# EAGLE design module_bga (EAGLE 9.4.0)

## Sheet 1 of 5
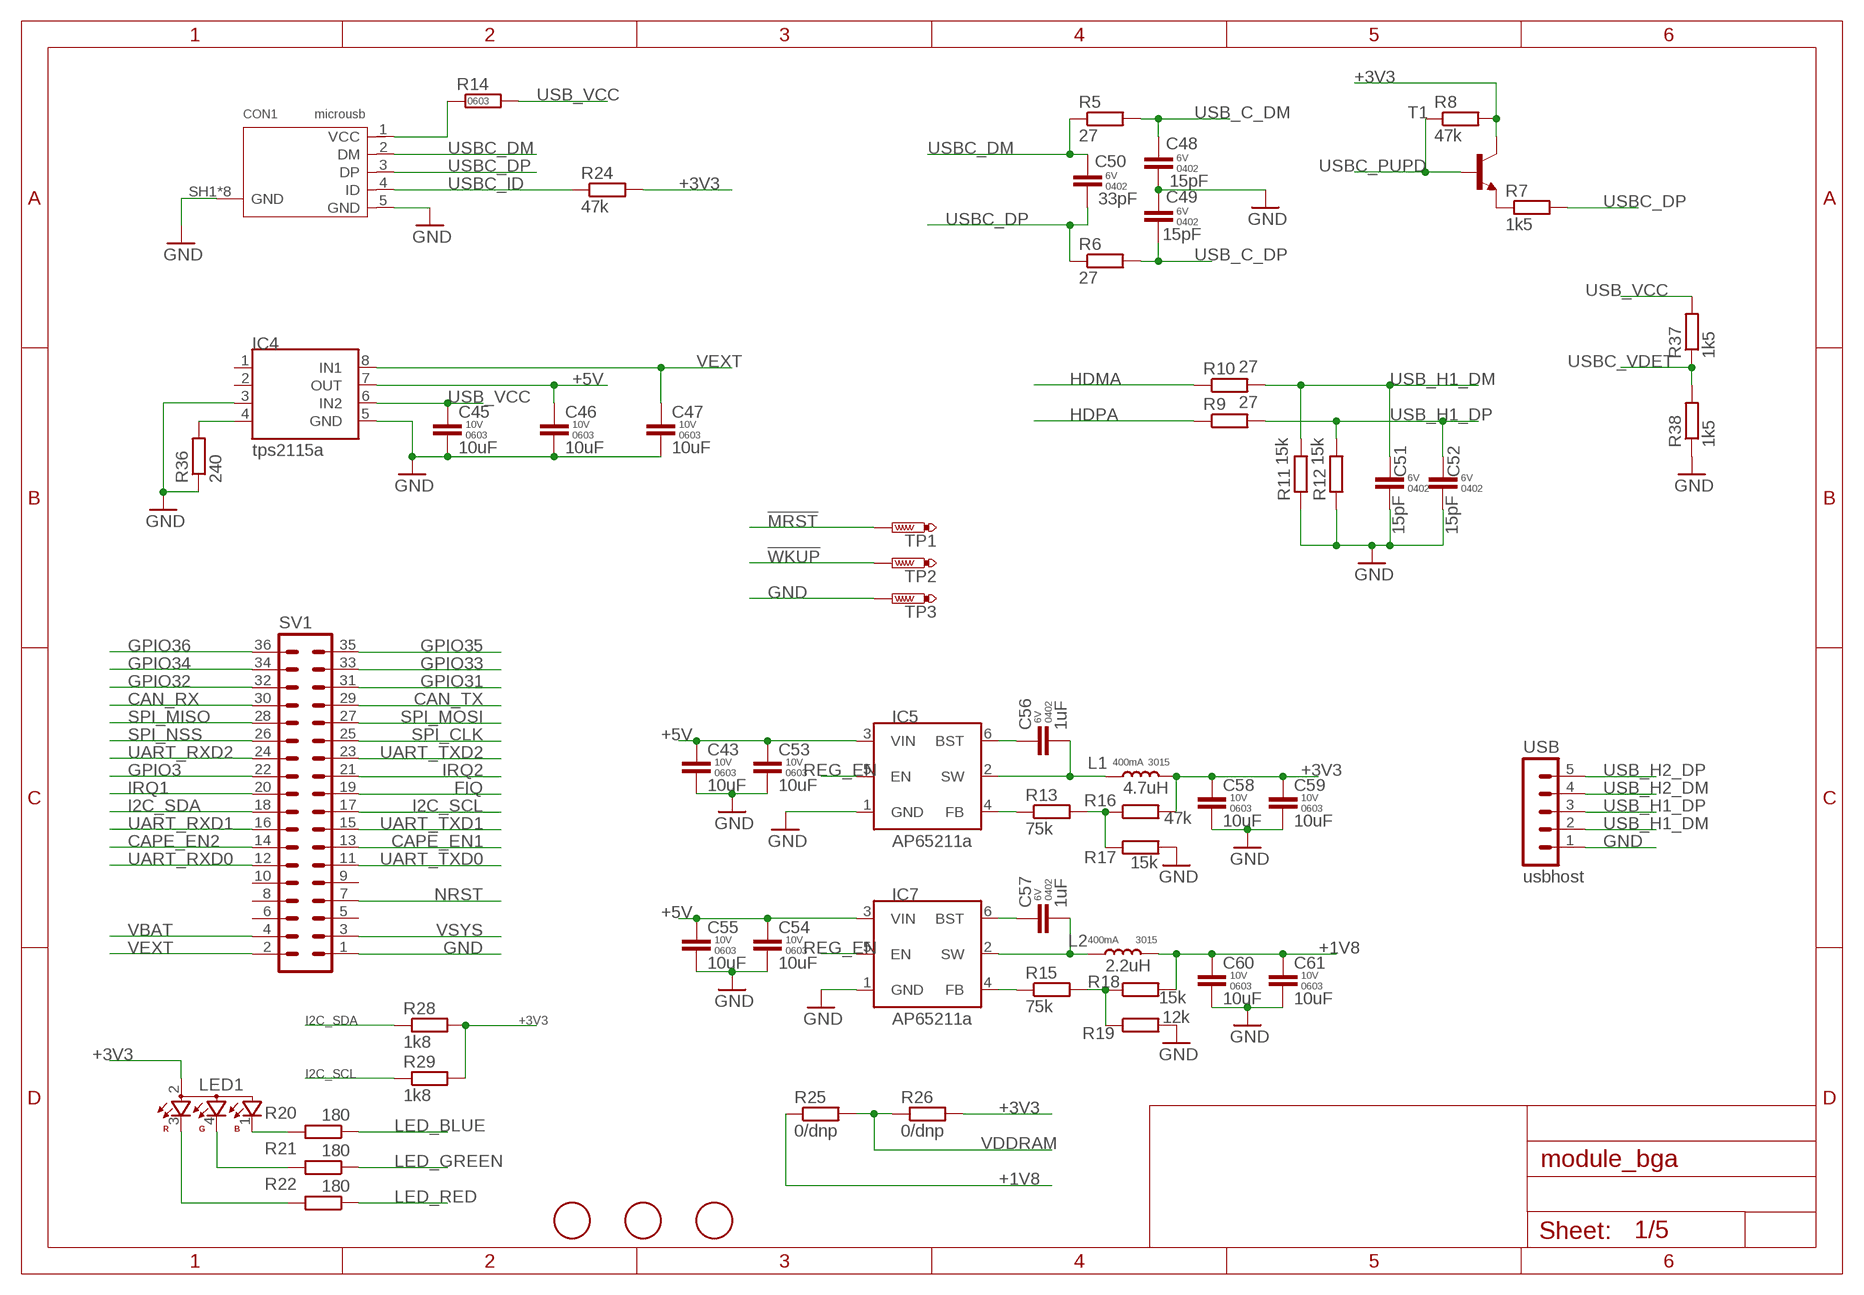
[diagram p0: schematic, sheet 1]

### Parts
C43  10uF  CAP-0603  [C0603]
C45  10uF  CAP-0603  [C0603]
C46  10uF  CAP-0603  [C0603]
C47  10uF  CAP-0603  [C0603]
C48  15pF  CAP-0402  [C0402K]
C49  15pF  CAP-0402  [C0402K]
C50  33pF  CAP-0402  [C0402K]
C51  15pF  CAP-0402  [C0402K]
C52  15pF  CAP-0402  [C0402K]
C53  10uF  CAP-0603  [C0603]
C54  10uF  CAP-0603  [C0603]
C55  10uF  CAP-0603  [C0603]
C56  1uF  CAP-0402  [C0402K]
C57  1uF  CAP-0402  [C0402K]
C58  10uF  CAP-0603  [C0603]
C59  10uF  CAP-0603  [C0603]
C60  10uF  CAP-0603  [C0603]
C61  10uF  CAP-0603  [C0603]
CON1  microusb  10118194-0001LF  [10118194]
IC4  tps2115a  TPS2115A  [TSSOP8]
IC5  AP65211  [SOT95P280X110-6]
IC7  AP65211  [SOT95P280X110-6]
L1  4.7uH  DJNR3015  [L3230M]
L2  2.2uH  DJNR3015  [L3230M]
LED1  OSTB1204C1E  [321015RGB]
R5  27  R-EU_R0402  [R0402]
R6  27  R-EU_R0402  [R0402]
R7  1k5  R-EU_R0402  [R0402]
R8  47k  R-EU_R0402  [R0402]
R9  27  R-EU_R0402  [R0402]
R10  27  R-EU_R0402  [R0402]
R11  15k  R-EU_R0402  [R0402]
R12  15k  R-EU_R0402  [R0402]
R13  75k  R-EU_R0402  [R0402]
R14  RES-0603  [R0603]
R15  75k  R-EU_R0402  [R0402]
R16  47k  R-EU_R0402  [R0402]
R17  15k  R-EU_R0402  [R0402]
R18  15k  R-EU_R0402  [R0402]
R19  12k  R-EU_R0402  [R0402]
R20  180  R-EU_R0402  [R0402]
R21  180  R-EU_R0402  [R0402]
R22  180  R-EU_R0402  [R0402]
R24  47k  R-EU_R0402  [R0402]
R25  0/dnp  R-EU_R0603  [R0603]
R26  0/dnp  R-EU_R0603  [R0603]
R28  1k8  R-EU_R0402  [R0402]
R29  1k8  R-EU_R0402  [R0402]
R36  240  R-EU_R0402  [R0402]
R37  1k5  R-EU_R0402  [R0402]
R38  1k5  R-EU_R0402  [R0402]
SV1  MA18-2  [MA18-2]
T1  MMBT2222ALT1-NPN-SOT23-BEC  [SOT23-BEC]
TP1  PTR1B1,27  [B1,27]
TP2  PTR1B1,27  [B1,27]
TP3  PTR1B1,27  [B1,27]
U$1  FIDUCIAL  [FIDUCIAL_1MM]
U$2  FIDUCIAL  [FIDUCIAL_1MM]
U$3  FIDUCIAL  [FIDUCIAL_1MM]
USB  usbhost  MA05-1  [MA05-1]

### Nets
!MRST: TP1.TP ; also sheet 2
!WKUP: TP2.TP ; also sheet 2
+1V8: C60.1 C61.1 L2.2 R18.2 R25.1 ; also sheet 2
+3V3: C58.1 C59.1 L1.2 LED1.2 R8.2 R16.2 R24.2 R26.2 R28.2 R29.2 T1.C ; also sheet 2,5
+5V: C43.1 C46.1 C53.1 C54.1 C55.1 IC4.7(OUT) IC5.3(VIN) IC7.3(VIN)
CAN_RX: SV1.30
CAN_TX: SV1.29
CAPE_EN1: SV1.13
CAPE_EN2: SV1.14
FIQ: SV1.19 ; also sheet 2
GND: C43.2 C45.2 C46.2 C47.2 C48.2 C49.2 C51.2 C52.2 C53.2 C54.2 C55.2 C58.2 C59.2 C60.2 C61.2 CON1.5(GND) CON1.SH1(GND) CON1.SH2(GND) CON1.SH3(GND) CON1.SH4(GND) CON1.SH5(GND) CON1.SH6(GND) CON1.SH7(GND) CON1.SH8(GND) IC4.3 IC4.5(GND) IC5.1(GND) IC7.1(GND) R11.1 R12.1 R17.2 R19.2 R36.1 R38.1 SV1.1 TP3.TP USB.1 ; also sheet 2,3,5
GPIO3: SV1.22
GPIO31: SV1.31 ; also sheet 2
GPIO32: SV1.32 ; also sheet 2
GPIO33: SV1.33 ; also sheet 2
GPIO34: SV1.34 ; also sheet 2
GPIO35: SV1.35 ; also sheet 2
GPIO36: SV1.36 ; also sheet 2
HDMA: R10.1 ; also sheet 2
HDPA: R9.1 ; also sheet 2
I2C_SCL: R29.1 SV1.17 ; also sheet 2
I2C_SDA: R28.1 SV1.18 ; also sheet 2
IRQ1: SV1.20 ; also sheet 2
IRQ2: SV1.21 ; also sheet 2
LED_BLUE: R20.1 ; also sheet 2
LED_GREEN: R21.1 ; also sheet 2
LED_RED: R22.1 ; also sheet 2
N$3: C56.2 IC5.2(SW) L1.1
N$4: CON1.1(VCC) R14.1
N$6: IC4.4 R36.2
N$8: C57.2 IC7.2(SW) L2.1
N$9: LED1.1 R20.2
N$10: C56.1 IC5.6(BST)
N$11: C57.1 IC7.6(BST)
N$14: LED1.4 R21.2
N$15: IC7.4(FB) R15.1
N$18: R7.1 T1.E
N$20: IC5.4(FB) R13.1
N$21: R15.2 R18.1 R19.1
N$22: R13.2 R16.1 R17.1
N$23: LED1.3 R22.2
NRST: SV1.7 ; also sheet 2
REG_EN: IC5.5(EN) IC7.5(EN)
SPI_CLK: SV1.25 ; also sheet 2
SPI_MISO: SV1.28 ; also sheet 2
SPI_MOSI: SV1.27 ; also sheet 2
SPI_NSS: SV1.26 ; also sheet 2
UART_RXD0: SV1.12 ; also sheet 2
UART_RXD1: SV1.16 ; also sheet 2
UART_RXD2: SV1.24 ; also sheet 2
UART_TXD0: SV1.11 ; also sheet 2
UART_TXD1: SV1.15 ; also sheet 2
UART_TXD2: SV1.23 ; also sheet 2
USB_C_DM: C48.1 R5.2 ; also sheet 2
USB_C_DP: C49.1 R6.2 ; also sheet 2
USB_H1_DM: C51.1 R10.2 R11.2 USB.2
USB_H1_DP: C52.1 R9.2 R12.2 USB.3
USB_H2_DM: USB.4
USB_H2_DP: USB.5
USB_VCC: C45.1 IC4.6(IN2) R14.2 R37.2
USBC_DM: C50.1 CON1.2(DM) R5.1
USBC_DP: C50.2 CON1.3(DP) R6.1 R7.2
USBC_ID: CON1.4(ID) R24.1 ; also sheet 2
USBC_PUPD: R8.1 T1.B ; also sheet 2
USBC_VDET: R37.1 R38.2 ; also sheet 2
VBAT: SV1.4
VDDRAM: R25.2 R26.1 ; also sheet 2,3
VEXT: C47.1 IC4.8(IN1) SV1.2
VSYS: SV1.3
Unconnected: IC4.1 IC4.2 SV1.5 SV1.6 SV1.8 SV1.9 SV1.10

## Sheet 2 of 5
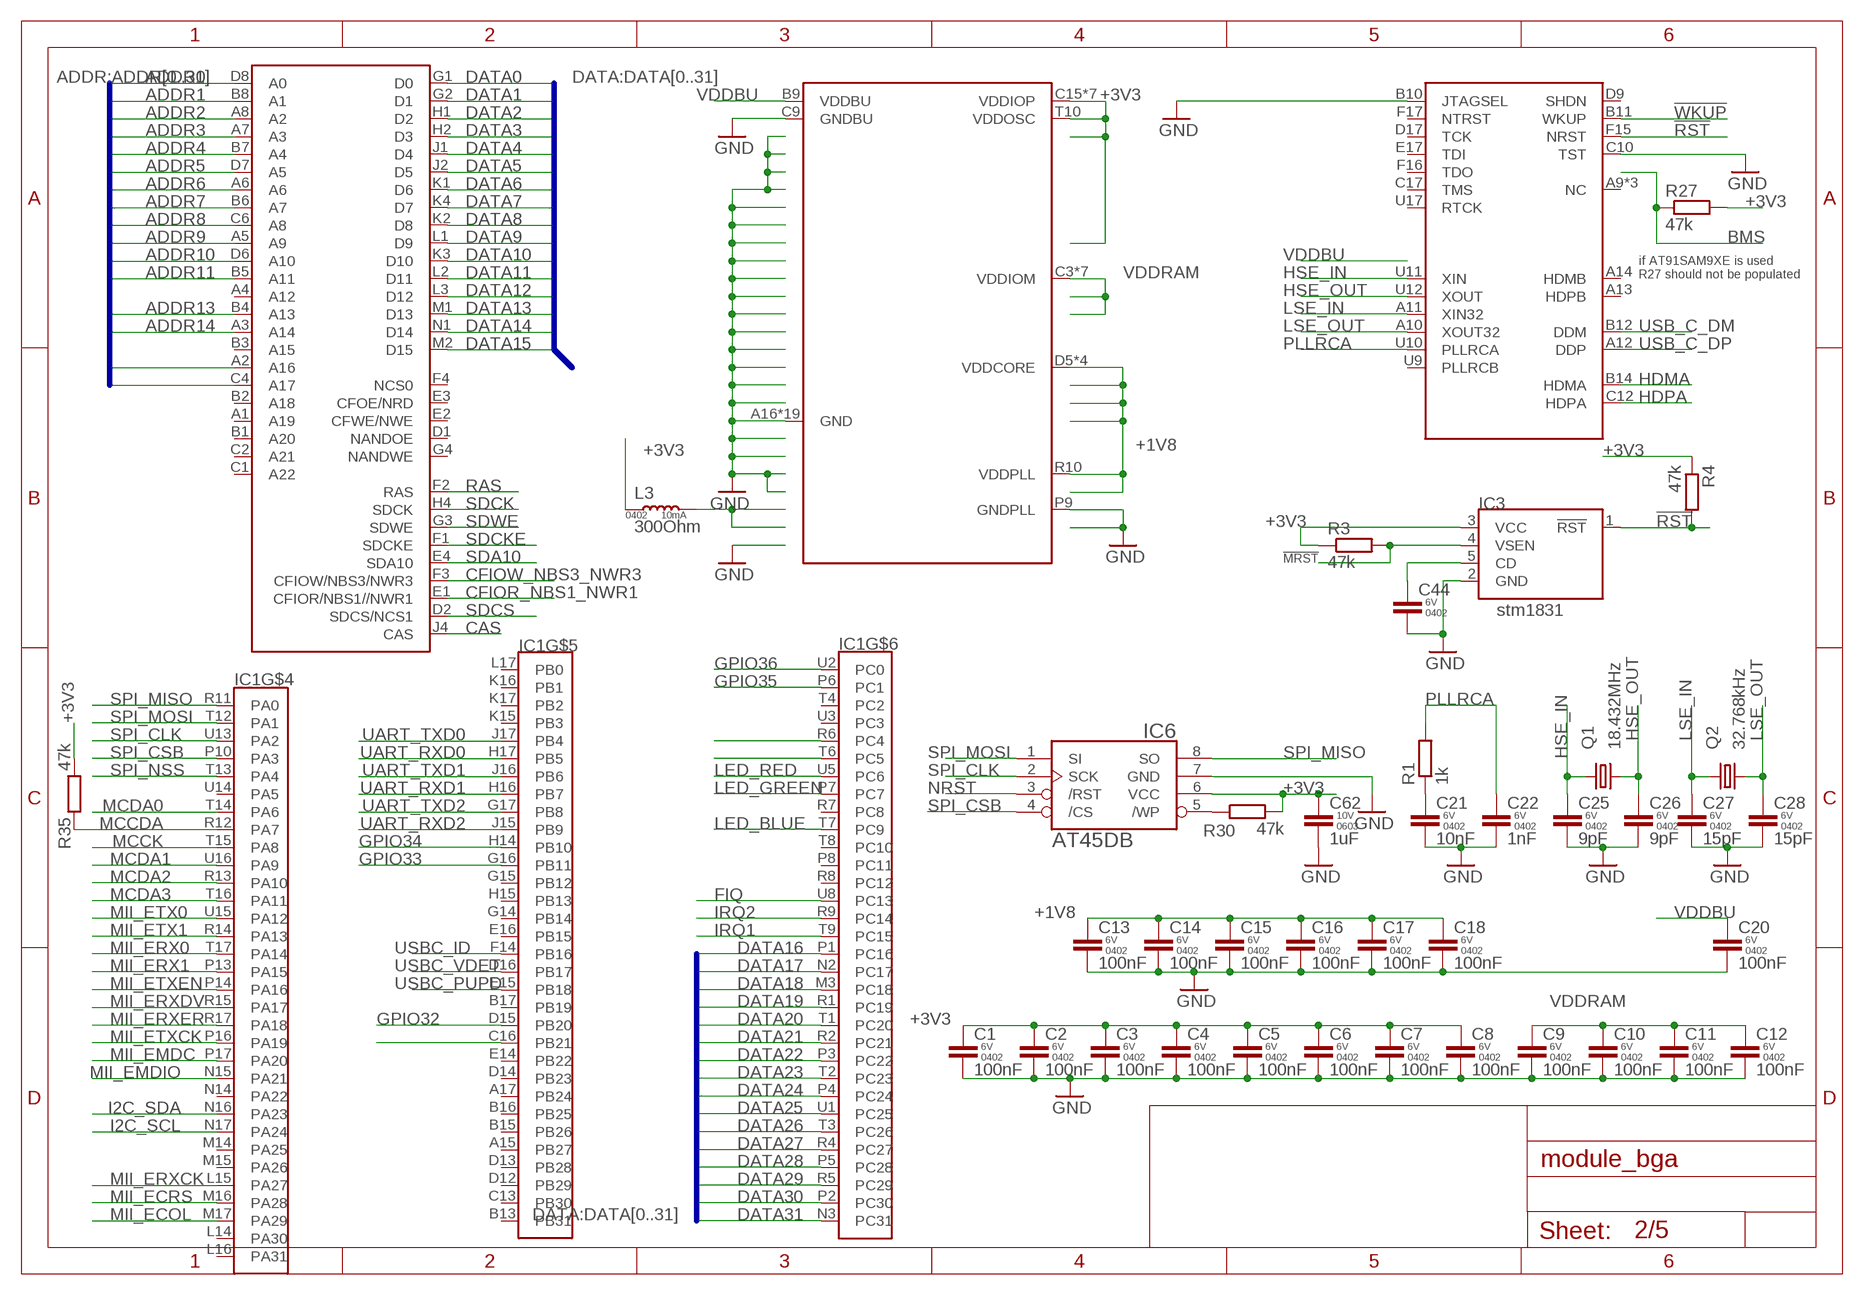
[diagram p1: schematic, sheet 2]

### Parts
C1  100nF  CAP-0402  [C0402K]
C2  100nF  CAP-0402  [C0402K]
C3  100nF  CAP-0402  [C0402K]
C4  100nF  CAP-0402  [C0402K]
C5  100nF  CAP-0402  [C0402K]
C6  100nF  CAP-0402  [C0402K]
C7  100nF  CAP-0402  [C0402K]
C8  100nF  CAP-0402  [C0402K]
C9  100nF  CAP-0402  [C0402K]
C10  100nF  CAP-0402  [C0402K]
C11  100nF  CAP-0402  [C0402K]
C12  100nF  CAP-0402  [C0402K]
C13  100nF  CAP-0402  [C0402K]
C14  100nF  CAP-0402  [C0402K]
C15  100nF  CAP-0402  [C0402K]
C16  100nF  CAP-0402  [C0402K]
C17  100nF  CAP-0402  [C0402K]
C18  100nF  CAP-0402  [C0402K]
C20  100nF  CAP-0402  [C0402K]
C21  10nF  CAP-0402  [C0402K]
C22  1nF  CAP-0402  [C0402K]
C25  9pF  CAP-0402  [C0402K]
C26  9pF  CAP-0402  [C0402K]
C27  15pF  CAP-0402  [C0402K]
C28  15pF  CAP-0402  [C0402K]
C44  CAP-0402  [C0402K]
C62  1uF  CAP-0603  [C0603]
IC1  AT91SAM9261-BGA  [BGA217C80P17X17_1500X1500X100]
IC3  stm1831  STM1831  [SOT95P280X100-5]
IC6  AT45DB-S  [SO08-208]
L3  300Ohm  IND-0402  [L0402]
Q1  18.432MHz  3215-7  [3215]
Q2  32.768kHz  CFPX–217-NHT  [3215]
R1  1k  R-EU_R0402  [R0402]
R3  47k  R-EU_R0402  [R0402]
R4  47k  R-EU_R0402  [R0402]
R27  47k  R-EU_R0402  [R0402]
R30  47k  R-EU_R0402  [R0402]
R35  47k  R-EU_R0402  [R0402]

### Nets
!MRST: IC3.4(VSEN) R3.2 ; also sheet 1
!RST: IC1.F15(NRST) IC3.1(!RST) R4.2
!WKUP: IC1.B11(WKUP) ; also sheet 1
+1V8: C13.1 C14.1 C15.1 C16.1 C17.1 C18.1 IC1.D5(VDDCORE) IC1.K14(VDDCORE) IC1.M4(VDDCORE) IC1.P12(VDDCORE) IC1.R10(VDDPLL) ; also sheet 1
+3V3: C1.1 C2.1 C3.1 C4.1 C5.1 C6.1 C7.1 C8.1 C62.1 IC1.C15(VDDIOP) IC1.D11(VDDIOP) IC1.J14(VDDIOP) IC1.P11(VDDIOP) IC1.P15(VDDIOP) IC1.T5(VDDIOP) IC1.T10(VDDOSC) IC1.U6(VDDIOP) IC3.3(VCC) IC6.6(VCC) L3.1 R3.1 R4.1 R27.2 R30.2 R35.2 ; also sheet 1,5
ADDR0: IC1.D8(A0) ; also sheet 3
ADDR1: IC1.B8(A1) ; also sheet 3
ADDR2: IC1.A8(A2) ; also sheet 3
ADDR3: IC1.A7(A3) ; also sheet 3
ADDR4: IC1.B7(A4) ; also sheet 3
ADDR5: IC1.D7(A5) ; also sheet 3
ADDR6: IC1.A6 ; also sheet 3
ADDR7: IC1.B6(A7) ; also sheet 3
ADDR8: IC1.C6(A8) ; also sheet 3
ADDR9: IC1.A5(A9) ; also sheet 3
ADDR10: IC1.D6(A10) ; also sheet 3
ADDR11: IC1.B5(A11) ; also sheet 3
ADDR13: IC1.B4(A13) ; also sheet 3
ADDR14: IC1.A3(A14) ; also sheet 3
ADDR16: IC1.A2(A16) ; also sheet 3
ADDR17: IC1.C4(A17) ; also sheet 3
BMS: R27.1
CAS: IC1.J4(CAS) ; also sheet 3
CFIOR_NBS1_NWR1: IC1.E1(CFIOR/NBS1//NWR1) ; also sheet 3
CFIOW_NBS3_NWR3: IC1.F3(CFIOW/NBS3/NWR3) ; also sheet 3
DATA0: IC1.G1(D0) ; also sheet 3
DATA1: IC1.G2(D1) ; also sheet 3
DATA2: IC1.H1(D2) ; also sheet 3
DATA3: IC1.H2(D3) ; also sheet 3
DATA4: IC1.J1(D4) ; also sheet 3
DATA5: IC1.J2(D5) ; also sheet 3
DATA6: IC1.K1(D6) ; also sheet 3
DATA7: IC1.K4(D7) ; also sheet 3
DATA8: IC1.K2(D8) ; also sheet 3
DATA9: IC1.L1(D9) ; also sheet 3
DATA10: IC1.K3(D10) ; also sheet 3
DATA11: IC1.L2(D11) ; also sheet 3
DATA12: IC1.L3(D12) ; also sheet 3
DATA13: IC1.M1(D13) ; also sheet 3
DATA14: IC1.N1(D14) ; also sheet 3
DATA15: IC1.M2(D15) ; also sheet 3
DATA16: IC1.P1(PC16) ; also sheet 3
DATA17: IC1.N2(PC17) ; also sheet 3
DATA18: IC1.M3(PC18) ; also sheet 3
DATA19: IC1.R1(PC19) ; also sheet 3
DATA20: IC1.T1(PC20) ; also sheet 3
DATA21: IC1.R2(PC21) ; also sheet 3
DATA22: IC1.P3(PC22) ; also sheet 3
DATA23: IC1.T2(PC23) ; also sheet 3
DATA24: IC1.P4(PC24) ; also sheet 3
DATA25: IC1.U1(PC25) ; also sheet 3
DATA26: IC1.T3(PC26) ; also sheet 3
DATA27: IC1.R4(PC27) ; also sheet 3
DATA28: IC1.P5(PC28) ; also sheet 3
DATA29: IC1.R5(PC29) ; also sheet 3
DATA30: IC1.P2(PC30) ; also sheet 3
DATA31: IC1.N3(PC31) ; also sheet 3
FIQ: IC1.U8(PC13) ; also sheet 1
GND: C1.2 C2.2 C3.2 C4.2 C5.2 C6.2 C7.2 C8.2 C9.2 C10.2 C11.2 C12.2 C13.2 C14.2 C15.2 C16.2 C17.2 C18.2 C20.2 C21.2 C22.2 C25.2 C26.2 C27.2 C28.2 C44.2 C62.2 IC1.A16(GND) IC1.C7(GND) IC1.C9(GNDBU) IC1.C10(TST) IC1.C11(GND) IC1.D3(GND) IC1.H8(GND) IC1.H9(GND) IC1.H10(GND) IC1.J3(GND) IC1.J8(GND) IC1.J9(GND) IC1.J10(GND) IC1.K8(GND) IC1.K9(GND) IC1.K10(GND) IC1.P9(GNDPLL) IC1.R3(GND) IC1.R16(GND) IC1.T11(GND) IC1.U4(GND) IC1.U7(GND) IC3.2(GND) IC6.7(GND) ; also sheet 1,3,5
GPIO31: IC1.C16(PB21) ; also sheet 1
GPIO32: IC1.D15(PB20) ; also sheet 1
GPIO33: IC1.G16(PB11) ; also sheet 1
GPIO34: IC1.H14(PB10) ; also sheet 1
GPIO35: IC1.P6(PC1) ; also sheet 1
GPIO36: IC1.U2(PC0) ; also sheet 1
HDMA: IC1.B14(HDMA) ; also sheet 1
HDPA: IC1.C12(HDPA) ; also sheet 1
HSE_IN: C25.1 IC1.U11(XIN) Q1.1
HSE_OUT: C26.1 IC1.U12(XOUT) Q1.3
I2C_SCL: IC1.N17(PA24) ; also sheet 1
I2C_SDA: IC1.N16(PA23) ; also sheet 1
IRQ1: IC1.T9(PC15) ; also sheet 1
IRQ2: IC1.R9(PC14) ; also sheet 1
LED_BLUE: IC1.T7(PC9) ; also sheet 1
LED_GREEN: IC1.P7(PC7) ; also sheet 1
LED_RED: IC1.U5(PC6) ; also sheet 1
LSE_IN: C27.1 IC1.A11(XIN32) Q2.1
LSE_OUT: C28.1 IC1.A10(XOUT32) Q2.2
MCCDA: IC1.R12(PA7) R35.1 ; also sheet 5
MCCK: IC1.T15(PA8) ; also sheet 5
MCDA0: IC1.T14(PA6) ; also sheet 5
MCDA1: IC1.U16(PA9) ; also sheet 5
MCDA2: IC1.R13(PA10) ; also sheet 5
MCDA3: IC1.T16(PA11) ; also sheet 5
MII_ECOL: IC1.M17(PA29)
MII_ECRS: IC1.M16(PA28)
MII_EMDC: IC1.P17(PA20) ; also sheet 4
MII_EMDIO: IC1.N15(PA21) ; also sheet 4
MII_ERX0: IC1.T17(PA14) ; also sheet 4
MII_ERX1: IC1.P13(PA15) ; also sheet 4
MII_ERXCK: IC1.L15(PA27)
MII_ERXDV: IC1.R15(PA17)
MII_ERXER: IC1.R17(PA18) ; also sheet 4
MII_ETX0: IC1.U15(PA12) ; also sheet 4
MII_ETX1: IC1.R14(PA13) ; also sheet 4
MII_ETXCK: IC1.P16(PA19) ; also sheet 4
MII_ETXEN: IC1.P14(PA16) ; also sheet 4
N$1: C21.1 R1.1
N$2: IC6.5(/WP) R30.1
N$5: IC1.B10(JTAGSEL) ; supply symbol labelled GND
N$13: IC1.T6(PC5)
N$16: IC1.R6(PC4)
N$17: C44.1 IC3.5(CD)
N$28: L3.2
NRST: IC6.3(/RST) ; also sheet 1
PLLRCA: C22.1 IC1.U10(PLLRCA) R1.2
RAS: IC1.F2(RAS) ; also sheet 3
SDA10: IC1.E4(SDA10) ; also sheet 3
SDCK: IC1.H4(SDCK) ; also sheet 3
SDCKE: IC1.F1(SDCKE) ; also sheet 3
SDCS: IC1.D2(SDCS/NCS1) ; also sheet 3
SDWE: IC1.G3(SDWE) ; also sheet 3
SPI_CLK: IC1.U13(PA2) IC6.2(SCK) ; also sheet 1
SPI_CSB: IC1.P10(PA3) IC6.4(/CS)
SPI_MISO: IC1.R11(PA0) IC6.8(SO) ; also sheet 1
SPI_MOSI: IC1.T12(PA1) IC6.1(SI) ; also sheet 1
SPI_NSS: IC1.T13(PA4) ; also sheet 1
UART_RXD0: IC1.H17(PB5) ; also sheet 1
UART_RXD1: IC1.H16(PB7) ; also sheet 1
UART_RXD2: IC1.J15(PB9) ; also sheet 1
UART_TXD0: IC1.J17(PB4) ; also sheet 1
UART_TXD1: IC1.J16(PB6) ; also sheet 1
UART_TXD2: IC1.G17(PB8) ; also sheet 1
USB_C_DM: IC1.B12(DDM) ; also sheet 1
USB_C_DP: IC1.A12(DDP) ; also sheet 1
USBC_ID: IC1.F14(PB16) ; also sheet 1
USBC_PUPD: IC1.E15(PB18) ; also sheet 1
USBC_VDET: IC1.D16(PB17) ; also sheet 1
VDDBU: C20.1 IC1.B9(VDDBU)
VDDRAM: C9.1 C10.1 C11.1 C12.1 IC1.C3(VDDIOM) IC1.C5(VDDIOM) IC1.C8(VDDIOM) IC1.D4(VDDIOM) IC1.H3(VDDIOM) IC1.L4(VDDIOM) IC1.N4(VDDIOM) ; also sheet 1,3
Unconnected: IC1.A1(A19) IC1.A4(A12) IC1.A9(NC) IC1.A13(HDPB) IC1.A14(HDMB) IC1.A15(PB27) IC1.A17(PB24) IC1.B1(A20) IC1.B2(A18) IC1.B3(A15) IC1.B13(PB31) IC1.B15(PB26) IC1.B16(PB25) IC1.B17(PB19) IC1.C1(A22) IC1.C2(A21) IC1.C13(PB30) IC1.C14(NC) IC1.C17(TMS) IC1.D1(NANDOE) IC1.D9(SHDN) IC1.D10(NC) IC1.D12(PB29) IC1.D13(PB28) IC1.D14(PB23) IC1.D17(TCK) IC1.E2(CFWE/NWE) IC1.E3(CFOE/NRD) IC1.E14(PB22) IC1.E16(PB15) IC1.E17(TDI) IC1.F4(NCS0) IC1.F16(TDO) IC1.F17(NTRST) IC1.G4(NANDWE) IC1.G14(PB14) IC1.G15(PB12) IC1.H15(PB13) IC1.K15(PB3) IC1.K16(PB1) IC1.K17(PB2) IC1.L14(PA30) IC1.L16(PA31) IC1.L17(PB0) IC1.M14(PA25) IC1.M15(PA26) IC1.N14(PA22) IC1.P8(PC11) IC1.R7(PC8) IC1.R8(PC12) IC1.T4(PC2) IC1.T8(PC10) IC1.U3(PC3) IC1.U9(PLLRCB) IC1.U14(PA5) IC1.U17(RTCK)

### Buses
ADDR:ADDR[0..31]
DATA:DATA[0..31]

### Notes on the sheet
- if AT91SAM9XE is used 
  R27 should not be populated

## Sheet 3 of 5: SDRAM
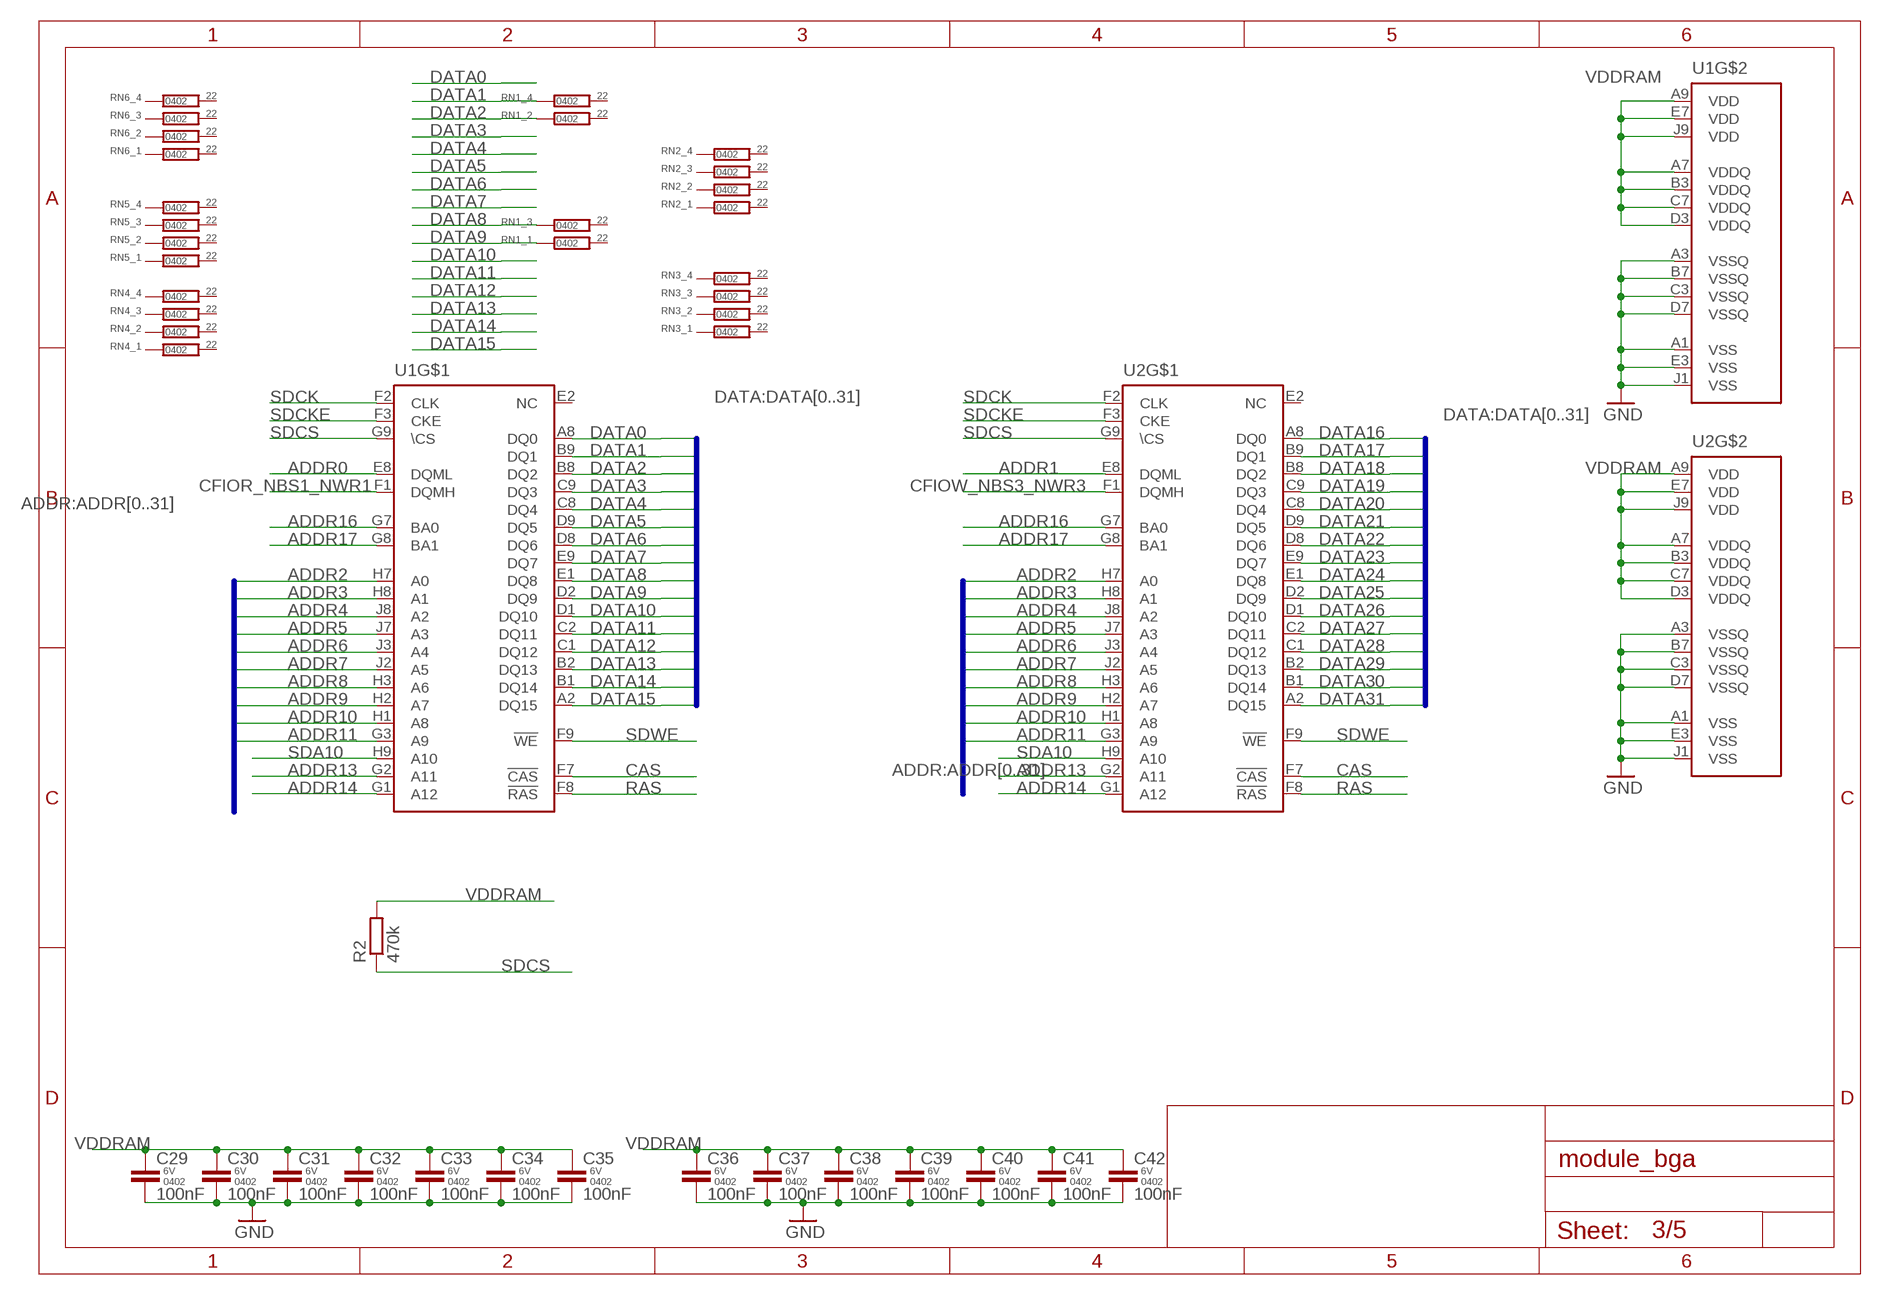
[diagram p2: schematic, sheet 3]

### Parts
C29  100nF  CAP-0402  [C0402K]
C30  100nF  CAP-0402  [C0402K]
C31  100nF  CAP-0402  [C0402K]
C32  100nF  CAP-0402  [C0402K]
C33  100nF  CAP-0402  [C0402K]
C34  100nF  CAP-0402  [C0402K]
C35  100nF  CAP-0402  [C0402K]
C36  100nF  CAP-0402  [C0402K]
C37  100nF  CAP-0402  [C0402K]
C38  100nF  CAP-0402  [C0402K]
C39  100nF  CAP-0402  [C0402K]
C40  100nF  CAP-0402  [C0402K]
C41  100nF  CAP-0402  [C0402K]
C42  100nF  CAP-0402  [C0402K]
R2  470k  R-EU_R0402  [R0402]
RN1  22  4D02WGJ0220  [4D02]
RN2  22  4D02WGJ0220  [4D02]
RN3  22  4D02WGJ0220  [4D02]
RN4  22  4D02WGJ0220  [4D02]
RN5  22  4D02WGJ0220  [4D02]
RN6  22  4D02WGJ0220  [4D02]
U1  IS42S16160G  [FBGA54]
U2  IS42S16160G  [FBGA54]

### Nets
ADDR0: U1.E8(DQML) ; also sheet 2
ADDR1: U2.E8(DQML) ; also sheet 2
ADDR2: U1.H7(A0) U2.H7(A0) ; also sheet 2
ADDR3: U1.H8(A1) U2.H8(A1) ; also sheet 2
ADDR4: U1.J8(A2) U2.J8(A2) ; also sheet 2
ADDR5: U1.J7(A3) U2.J7(A3) ; also sheet 2
ADDR6: U1.J3(A4) U2.J3(A4) ; also sheet 2
ADDR7: U1.J2(A5) U2.J2(A5) ; also sheet 2
ADDR8: U1.H3(A6) U2.H3(A6) ; also sheet 2
ADDR9: U1.H2(A7) U2.H2(A7) ; also sheet 2
ADDR10: U1.H1(A8) U2.H1(A8) ; also sheet 2
ADDR11: U1.G3(A9) U2.G3(A9) ; also sheet 2
ADDR13: U1.G2(A11) U2.G2(A11) ; also sheet 2
ADDR14: U1.G1(A12) U2.G1(A12) ; also sheet 2
ADDR16: U1.G7(BA0) U2.G7(BA0) ; also sheet 2
ADDR17: U1.G8(BA1) U2.G8(BA1) ; also sheet 2
CAS: U1.F7(!CAS) U2.F7(!CAS) ; also sheet 2
CFIOR_NBS1_NWR1: U1.F1(DQMH) ; also sheet 2
CFIOW_NBS3_NWR3: U2.F1(DQMH) ; also sheet 2
DATA0: U1.A8(DQ0) ; also sheet 2
DATA1: RN1.4 U1.B9(DQ1) ; also sheet 2
DATA2: RN1.2 U1.B8(DQ2) ; also sheet 2
DATA3: U1.C9(DQ3) ; also sheet 2
DATA4: U1.C8(DQ4) ; also sheet 2
DATA5: U1.D9(DQ5) ; also sheet 2
DATA6: U1.D8(DQ6) ; also sheet 2
DATA7: U1.E9(DQ7) ; also sheet 2
DATA8: RN1.3 U1.E1(DQ8) ; also sheet 2
DATA9: RN1.1 U1.D2(DQ9) ; also sheet 2
DATA10: U1.D1(DQ10) ; also sheet 2
DATA11: U1.C2(DQ11) ; also sheet 2
DATA12: U1.C1(DQ12) ; also sheet 2
DATA13: U1.B2(DQ13) ; also sheet 2
DATA14: U1.B1(DQ14) ; also sheet 2
DATA15: U1.A2(DQ15) ; also sheet 2
DATA16: U2.A8(DQ0) ; also sheet 2
DATA17: U2.B9(DQ1) ; also sheet 2
DATA18: U2.B8(DQ2) ; also sheet 2
DATA19: U2.C9(DQ3) ; also sheet 2
DATA20: U2.C8(DQ4) ; also sheet 2
DATA21: U2.D9(DQ5) ; also sheet 2
DATA22: U2.D8(DQ6) ; also sheet 2
DATA23: U2.E9(DQ7) ; also sheet 2
DATA24: U2.E1(DQ8) ; also sheet 2
DATA25: U2.D2(DQ9) ; also sheet 2
DATA26: U2.D1(DQ10) ; also sheet 2
DATA27: U2.C2(DQ11) ; also sheet 2
DATA28: U2.C1(DQ12) ; also sheet 2
DATA29: U2.B2(DQ13) ; also sheet 2
DATA30: U2.B1(DQ14) ; also sheet 2
DATA31: U2.A2(DQ15) ; also sheet 2
GND: C29.2 C30.2 C31.2 C32.2 C33.2 C34.2 C35.2 C36.2 C37.2 C38.2 C39.2 C40.2 C41.2 C42.2 U1.A1(VSS) U1.A3(VSSQ) U1.B7(VSSQ) U1.C3(VSSQ) U1.D7(VSSQ) U1.E3(VSS) U1.J1(VSS) U2.A1(VSS) U2.A3(VSSQ) U2.B7(VSSQ) U2.C3(VSSQ) U2.D7(VSSQ) U2.E3(VSS) U2.J1(VSS) ; also sheet 1,2,5
RAS: U1.F8(!RAS) U2.F8(!RAS) ; also sheet 2
SDA10: U1.H9(A10) U2.H9(A10) ; also sheet 2
SDCK: U1.F2(CLK) U2.F2(CLK) ; also sheet 2
SDCKE: U1.F3(CKE) U2.F3(CKE) ; also sheet 2
SDCS: R2.1 U1.G9(\CS) U2.G9(\CS) ; also sheet 2
SDWE: U1.F9(!WE) U2.F9(!WE) ; also sheet 2
VDDRAM: C29.1 C30.1 C31.1 C32.1 C33.1 C34.1 C35.1 C36.1 C37.1 C38.1 C39.1 C40.1 C41.1 C42.1 R2.2 U1.A7(VDDQ) U1.A9(VDD) U1.B3(VDDQ) U1.C7(VDDQ) U1.D3(VDDQ) U1.E7(VDD) U1.J9(VDD) U2.A7(VDDQ) U2.A9(VDD) U2.B3(VDDQ) U2.C7(VDDQ) U2.D3(VDDQ) U2.E7(VDD) U2.J9(VDD) ; also sheet 1,2
Unconnected: RN1.5 RN1.6 RN1.7 RN1.8 RN2.1 RN2.2 RN2.3 RN2.4 RN2.5 RN2.6 RN2.7 RN2.8 RN3.1 RN3.2 RN3.3 RN3.4 RN3.5 RN3.6 RN3.7 RN3.8 RN4.1 RN4.2 RN4.3 RN4.4 RN4.5 RN4.6 RN4.7 RN4.8 RN5.1 RN5.2 RN5.3 RN5.4 RN5.5 RN5.6 RN5.7 RN5.8 RN6.1 RN6.2 RN6.3 RN6.4 RN6.5 RN6.6 RN6.7 RN6.8 U1.E2(NC) U2.E2(NC)

### Buses
DATA:DATA[0..31]
ADDR:ADDR[0..31]

## Sheet 4 of 5: Ethernet
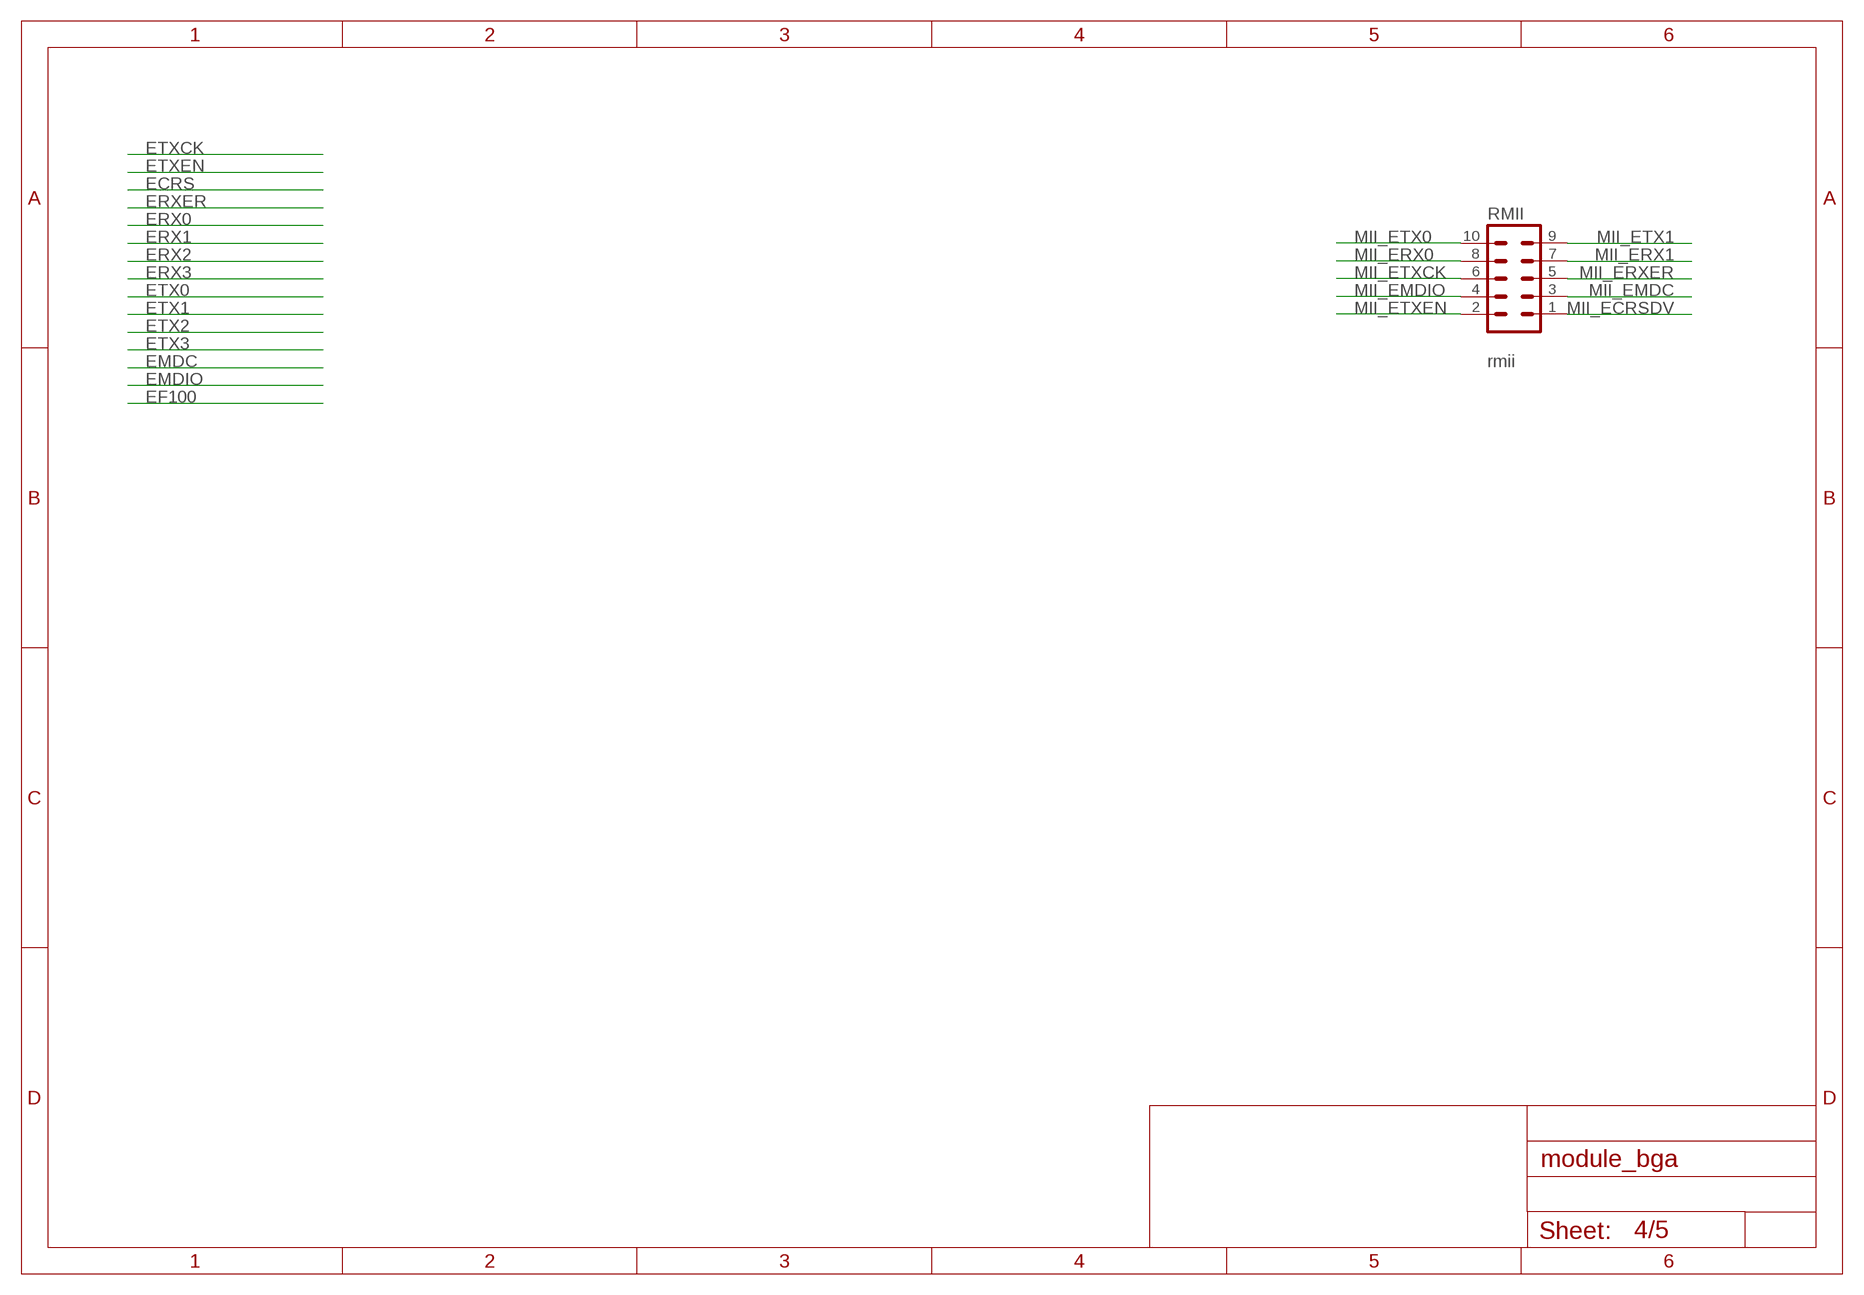
[diagram p3: schematic, sheet 4]

### Parts
RMII  rmii  MA05-2  [MA05-2]

### Nets
MII_ECRSDV: RMII.1
MII_EMDC: RMII.3 ; also sheet 2
MII_EMDIO: RMII.4 ; also sheet 2
MII_ERX0: RMII.8 ; also sheet 2
MII_ERX1: RMII.7 ; also sheet 2
MII_ERXER: RMII.5 ; also sheet 2
MII_ETX0: RMII.10 ; also sheet 2
MII_ETX1: RMII.9 ; also sheet 2
MII_ETXCK: RMII.6 ; also sheet 2
MII_ETXEN: RMII.2 ; also sheet 2

## Sheet 5 of 5: SD Card
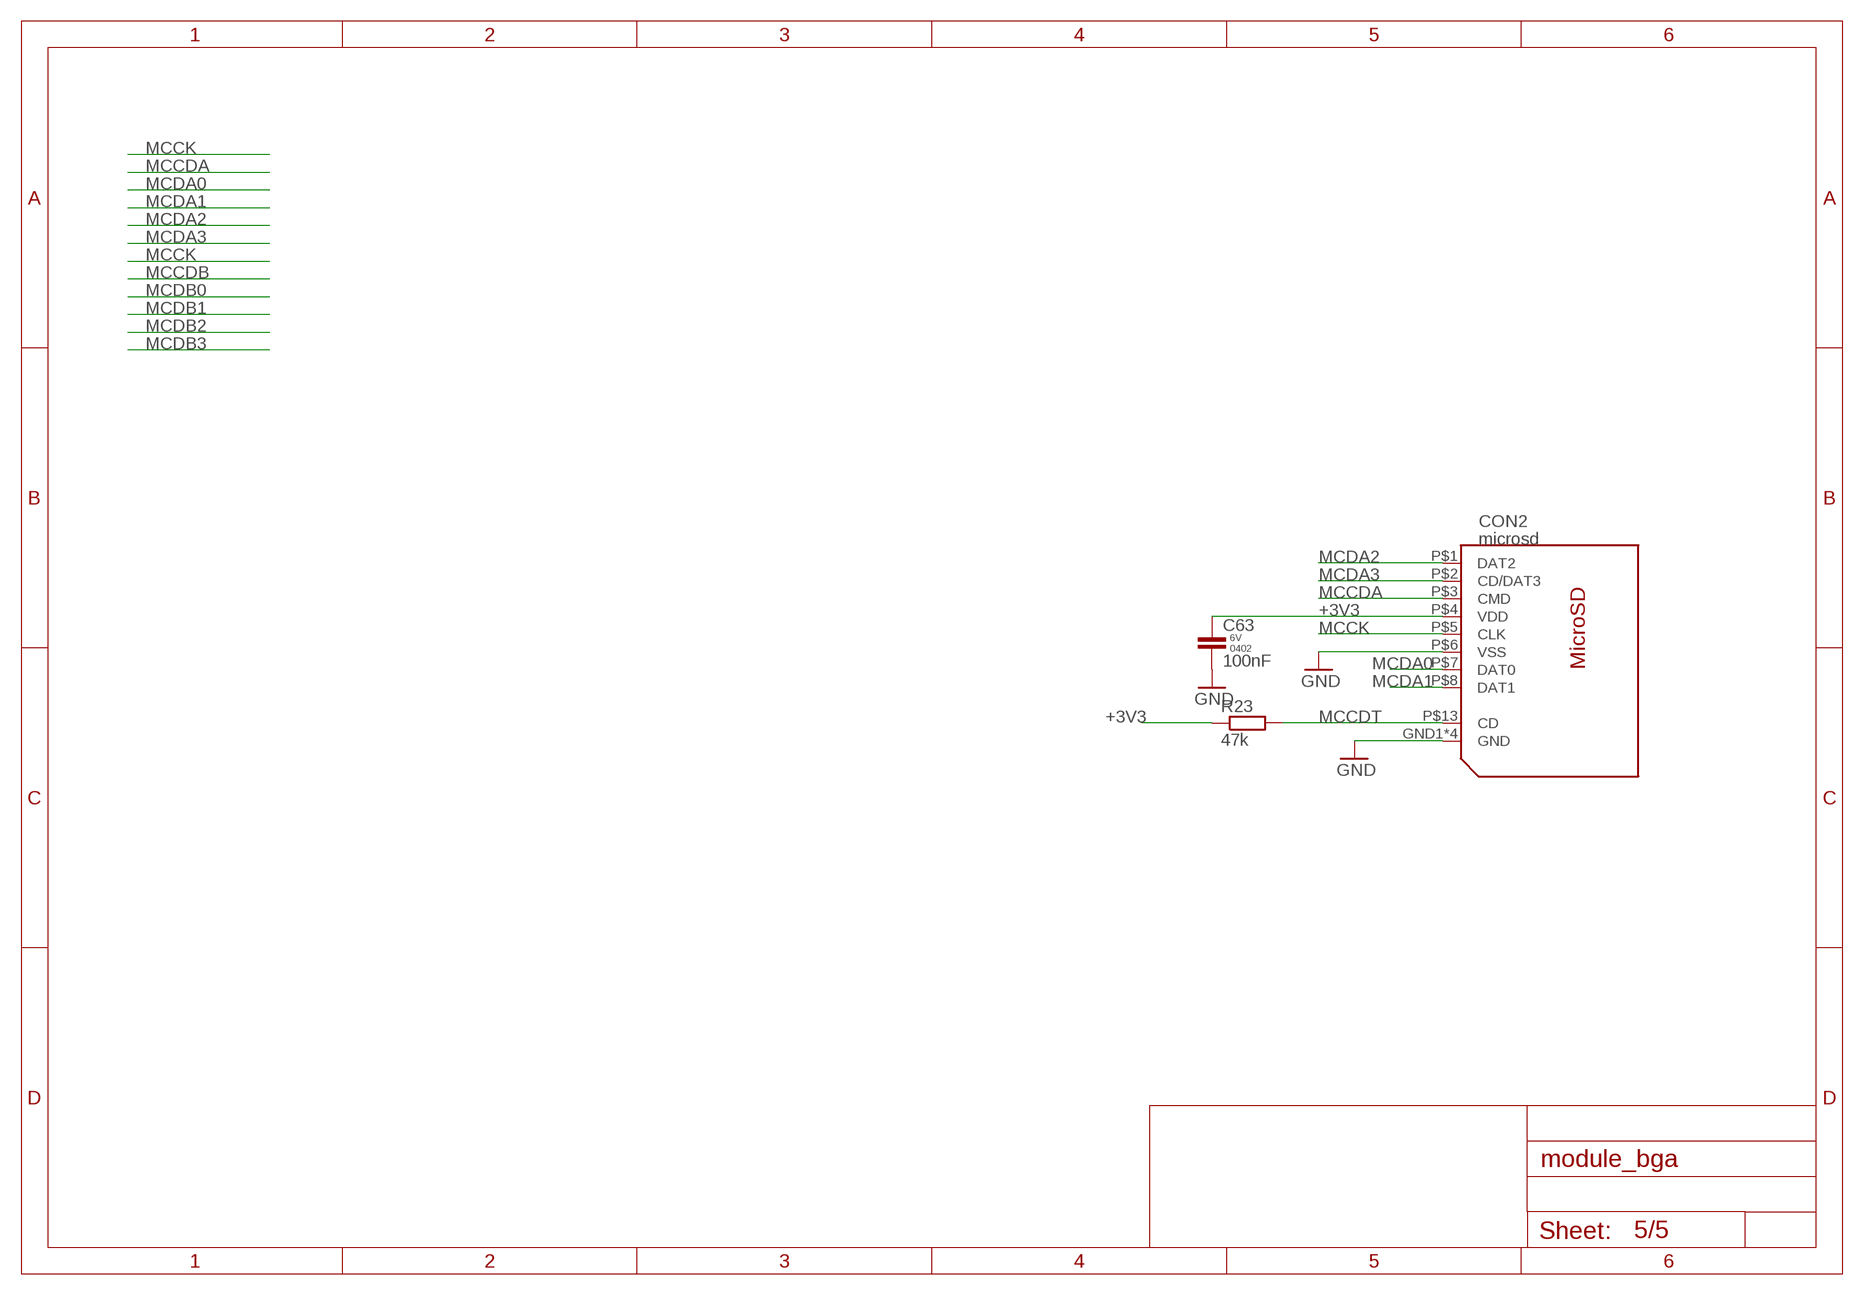
[diagram p4: schematic, sheet 5]

### Parts
C63  100nF  CAP-0402  [C0402K]
CON2  microsd  112J-TXAR  [112J]
R23  47k  R-EU_R0402  [R0402]

### Nets
+3V3: C63.1 CON2.P$4(VDD) R23.1 ; also sheet 1,2
GND: C63.2 CON2.GND1(GND) CON2.GND2(GND) CON2.GND3(GND) CON2.GND4(GND) CON2.P$6(VSS) ; also sheet 1,2,3
MCCDA: CON2.P$3(CMD) ; also sheet 2
MCCDT: CON2.P$13(CD) R23.2
MCCK: CON2.P$5(CLK) ; also sheet 2
MCDA0: CON2.P$7(DAT0) ; also sheet 2
MCDA1: CON2.P$8(DAT1) ; also sheet 2
MCDA2: CON2.P$1(DAT2) ; also sheet 2
MCDA3: CON2.P$2(CD/DAT3) ; also sheet 2

## Library data of the parts
C1-C18 C20-C22 C25-C42 C44 C48-C52 C56 C57 C63 = parts-passives:CAP-; PACKAGE: 0402; RATING: 6V
C43 C45-C47 C53-C55 C58-C62 = parts-passives:CAP-; PACKAGE: 0603; RATING: 10V
CON1 = parts-amphenol:10118194-00
CON2 = parts-attend:112J-TXAR
IC1 = parts-microchip:AT91SAM9261-BGA
IC3 = parts-st:STM1831: The STM1831 is a voltage detector with very low current consumption. It monitors a voltage on a separate input pin (VSEN), which is fully functional even if the monitored voltage goes down to 0 V. In addition, the delay of the output can be adjusted by an external capacitor
IC4 = parts-ti:TPS211
IC5 IC7 = parts-diodes:AP65211
IC6 = parts-adesto:AT45DB
L1 L2 = parts-ferrocore:DJNR3015; CURRENT: 400mA; PACKAGE: 3015
L3 = parts-passives:IND-; CURRENT: 10mA; PACKAGE: 0402
LED1 = parts-optosupply:OSTB1204
Q1 = parts-srpassives:3215: SMD Crystal 3.2x2.5
Q2 = parts-iqd:CFPX–217: 32.768
R1-R13 R15-R30 R35-R38 = rcl:R-EU_: RESISTOR, European symbol; SPICEPREFIX: R
R14 = parts-passives:RES-; PACKAGE: 0603
RMII = parts-passives:MA05-2: PIN HEADER; OC_FARNELL: unknown; OC_NEWARK: unknown
RN1-RN6 = parts-royal_ohm:4D02WGJ; CASE: 0402
SV1 = parts-passives:MA18-2: PIN HEADER; OC_FARNELL: unknown; OC_NEWARK: unknown
T1 = transistor:*-NPN-: NPN Transistror BF959 corrected 2008.03.06
TP1-TP3 = testpad:PTR1: TEST PIN
U1 U2 = parts-issi:IS42S16160G
U$1-U$3 = adafruit:FIDUCIAL: For use by pick and place machines to calibrate the vision/machine, 1mm By microbuilder.eu
USB = parts-passives:MA05-1: PIN HEADER; OC_FARNELL: unknown; OC_NEWARK: unknown

## Board
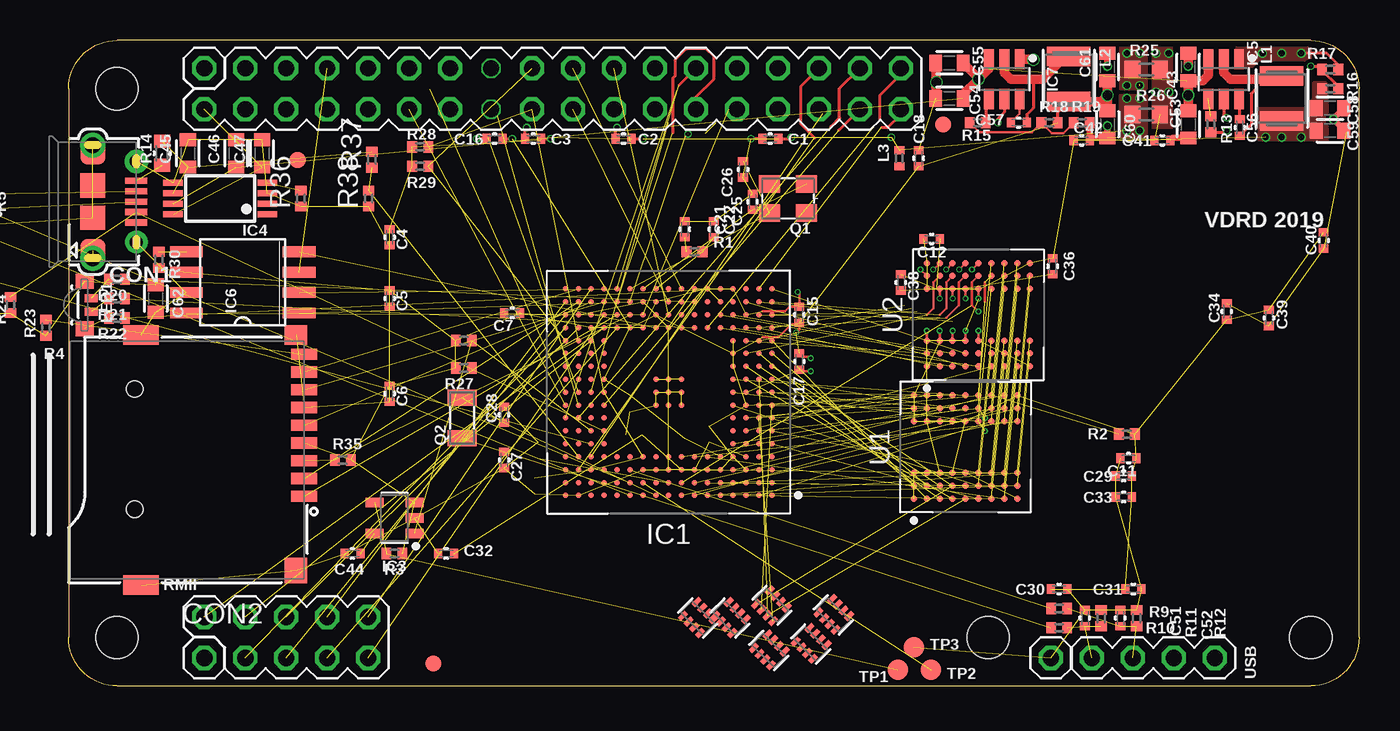
[diagram p5: board, top side]
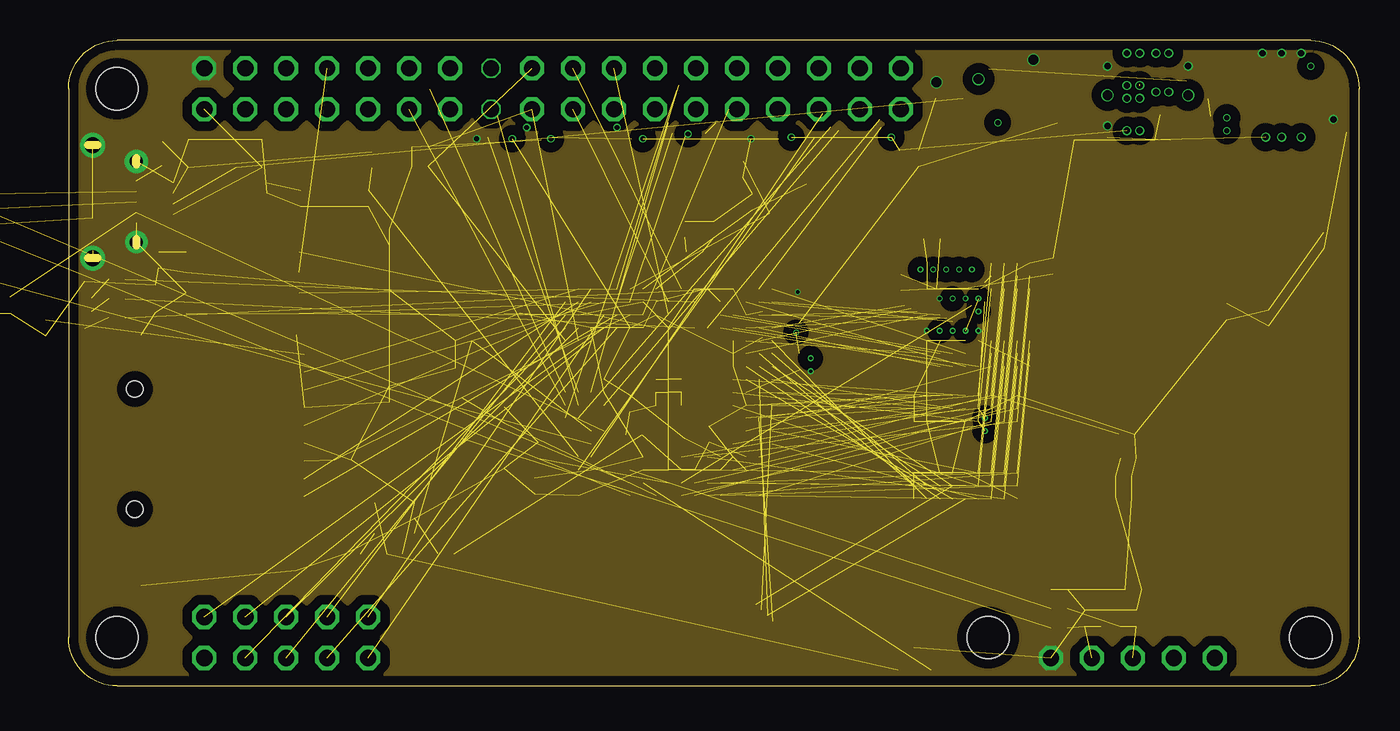
[diagram p6: board, inner layer Route2]
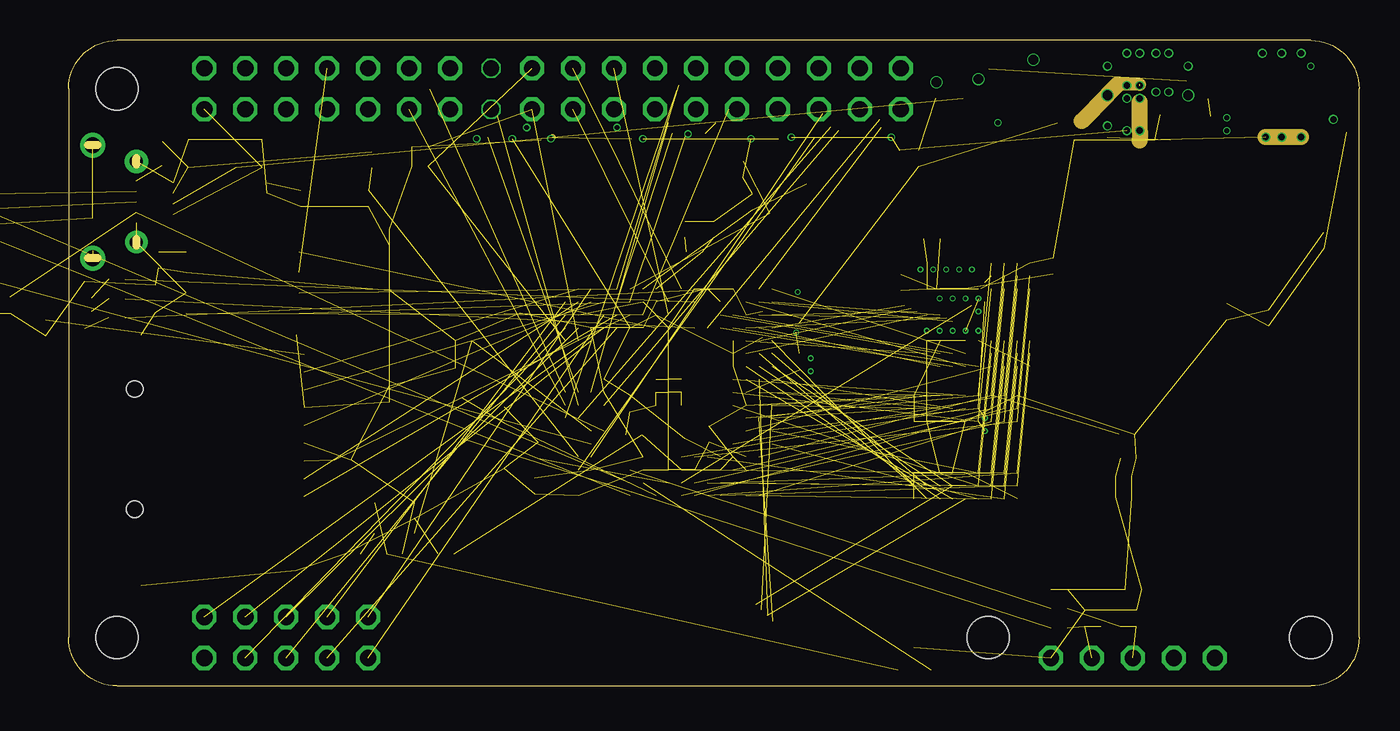
[diagram p7: board, inner layer Route15]
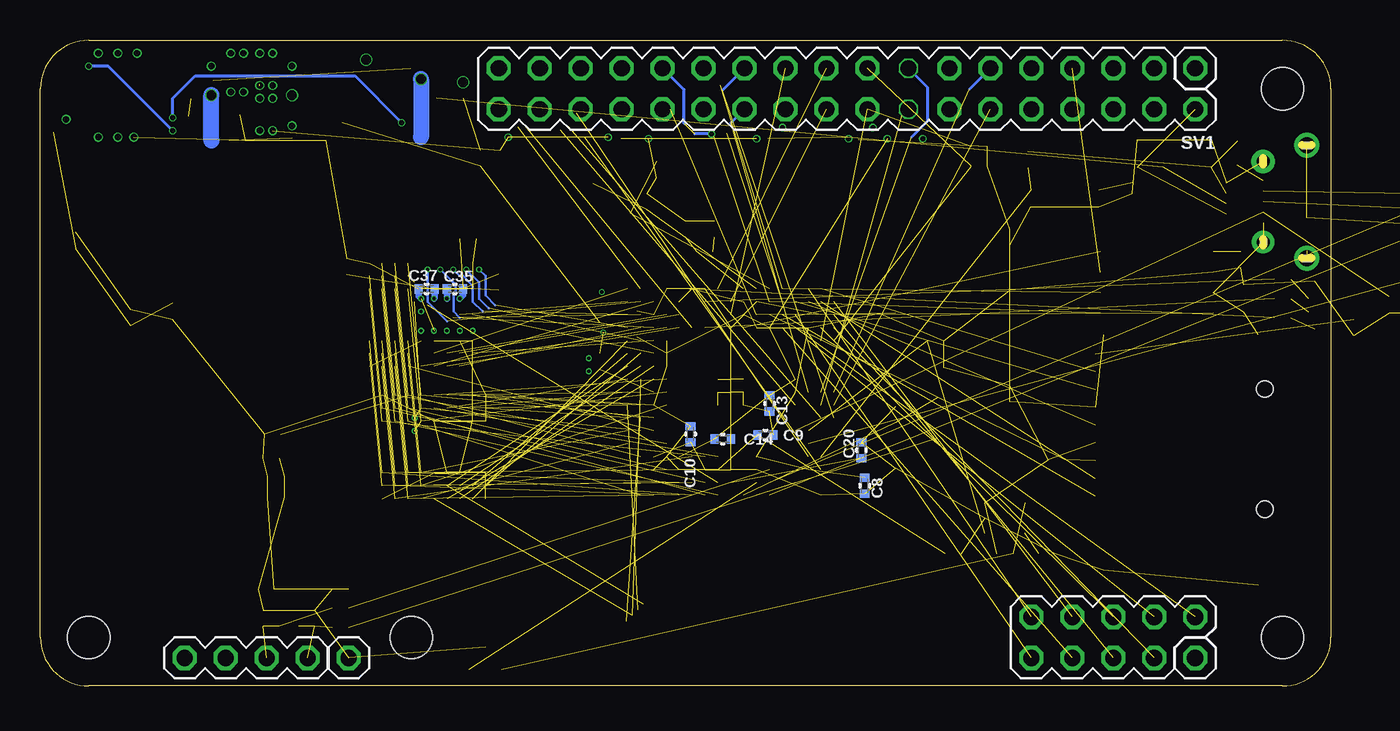
[diagram p8: board, bottom side, seen from below]

Size 80 x 40 mm. Coordinates in mm from the lower left corner, seen from the top.
Outline: 3,0 77,0 arc90 80,3 80,37 arc90 77,40 3,40 arc90 0,37 0,3 arc90 3,0
Copper layers (1+2*15+16): Top 0.035mm / dielectric 0.2mm / Route2 0.035mm / dielectric 0.8mm / Route15 0.035mm / dielectric 0.2mm / Bottom 0.035mm
Design rules "default *": minimum track width 4mil, minimum drill 0.2mm, track to track 4mil, track to pad 4mil, pad to pad 4mil, via to via 4mil, smd to smd 4mil, copper to edge 0.4mm, drill to drill 6mil, minimum pad ring 3mil, minimum via ring 3mil, stop-mask expansion 0.1mm, vias tented up to drill 0.3mm, thermal gap 10mil
Holes 2.6 mm at 3,37 3,3 77,3 57,3
tRestrict: area 0,34 to 6,40; area 0,0 to 6,6; area 74,0 to 80,6; area 54,0 to 60,6
bRestrict: area 0,34 to 6,40; area 0,0 to 6,6; area 74,0 to 80,6; area 54,0 to 60,6

### Footprints (pad centres in the part's own frame; a part is rotated, then mirrored left to right if it is on the bottom)
C0402K = smd 0.5 x 0.6: 1 -0.5,0; 2 0.5,0
C0603 = smd 0.8 x 1: 1 -0.85,0; 2 0.85,0
10118194 = smd 0.4 x 1.35: 1 -1.3,2.7; 2 -0.65,2.7; 3 0,2.7; 4 0.65,2.7; 5 1.3,2.7 | drill 0.8 pad 1.45: SH1 -2.5,2.7 | drill 0.8 pad 1.4: SH2 2.5,2.7 | drill 1 pad 1.55: SH3 -3.5,0; SH8 3.5,0 | smd 1.5 x 1.55: SH4 -3.05,0; SH5 -1,0; SH6 1,0; SH7 3.05,0
112J = smd 1.2 x 1.4: GND1 -7.75,-0.5 | smd 1.2 x 2.2: GND2 -7.75,-10.1; GND3 7.75,-10.1 | smd 1.6 x 1.4: GND4 6.85,-0.5 | smd 0.7 x 1.6: P$1 2.25,0; P$2 1.15,0; P$3 0.05,0; P$4 -1.05,0; P$5 -2.15,0; P$6 -3.25,0; P$7 -4.35,0; P$8 -5.45,0; P$13 -6.55,0 | hole 1: -4.4,-10.5; 3.05,-10.5
BGA217C80P17X17_1500X1500X100 = smd 0.35 x 0.35: A1 -6.4,6.4; A2 -5.6,6.4; A3 -4.8,6.4; A4 -4,6.4; A5 -3.2,6.4; A6 -2.4,6.4; A7 -1.6,6.4; A8 -0.8,6.4; A9 0,6.4; A10 0.8,6.4; A11 1.6,6.4; A12 2.4,6.4; A13 3.2,6.4; A14 4,6.4; A15 4.8,6.4; A16 5.6,6.4; A17 6.4,6.4; B1 -6.4,5.6; B2 -5.6,5.6; B3 -4.8,5.6; B4 -4,5.6; B5 -3.2,5.6; B6 -2.4,5.6; B7 -1.6,5.6; B8 -0.8,5.6; B9 0,5.6; B10 0.8,5.6; B11 1.6,5.6; B12 2.4,5.6; B13 3.2,5.6; B14 4,5.6; B15 4.8,5.6; B16 5.6,5.6; B17 6.4,5.6; C1 -6.4,4.8; C2 -5.6,4.8; C3 -4.8,4.8; C4 -4,4.8; C5 -3.2,4.8; C6 -2.4,4.8; C7 -1.6,4.8; C8 -0.8,4.8; C9 0,4.8; C10 0.8,4.8; C11 1.6,4.8; C12 2.4,4.8; C13 3.2,4.8; C14 4,4.8; C15 4.8,4.8; C16 5.6,4.8; C17 6.4,4.8; D1 -6.4,4; D2 -5.6,4; D3 -4.8,4; D4 -4,4; D5 -3.2,4; D6 -2.4,4; D7 -1.6,4; D8 -0.8,4; D9 0,4; D10 0.8,4; D11 1.6,4; D12 2.4,4; D13 3.2,4; D14 4,4; D15 4.8,4; D16 5.6,4; D17 6.4,4; E1 -6.4,3.2; E2 -5.6,3.2; E3 -4.8,3.2; E4 -4,3.2; E14 4,3.2; E15 4.8,3.2; E16 5.6,3.2; E17 6.4,3.2; F1 -6.4,2.4; F2 -5.6,2.4; F3 -4.8,2.4; F4 -4,2.4; F14 4,2.4; F15 4.8,2.4; F16 5.6,2.4; F17 6.4,2.4; G1 -6.4,1.6; G2 -5.6,1.6; G3 -4.8,1.6; G4 -4,1.6; G14 4,1.6; G15 4.8,1.6; G16 5.6,1.6; G17 6.4,1.6; H1 -6.4,0.8; H2 -5.6,0.8; H3 -4.8,0.8; H4 -4,0.8; H8 -0.8,0.8; H9 0,0.8; H10 0.8,0.8; H14 4,0.8; H15 4.8,0.8; H16 5.6,0.8; H17 6.4,0.8; J1 -6.4,0; J2 -5.6,0; J3 -4.8,0; J4 -4,0; J8 -0.8,0; J9 0,0; J10 0.8,0; J14 4,0; J15 4.8,0; J16 5.6,0; J17 6.4,0; K1 -6.4,-0.8; K2 -5.6,-0.8; K3 -4.8,-0.8; K4 -4,-0.8; K8 -0.8,-0.8; K9 0,-0.8; K10 0.8,-0.8; K14 4,-0.8; K15 4.8,-0.8; K16 5.6,-0.8; K17 6.4,-0.8; L1 -6.4,-1.6; L2 -5.6,-1.6; L3 -4.8,-1.6; L4 -4,-1.6; L14 4,-1.6; L15 4.8,-1.6; L16 5.6,-1.6; L17 6.4,-1.6; M1 -6.4,-2.4; M2 -5.6,-2.4; M3 -4.8,-2.4; M4 -4,-2.4; M14 4,-2.4; M15 4.8,-2.4; M16 5.6,-2.4; M17 6.4,-2.4; N1 -6.4,-3.2; N2 -5.6,-3.2; N3 -4.8,-3.2; N4 -4,-3.2; N14 4,-3.2; N15 4.8,-3.2; N16 5.6,-3.2; N17 6.4,-3.2; P1 -6.4,-4; P2 -5.6,-4; P3 -4.8,-4; P4 -4,-4; P5 -3.2,-4; P6 -2.4,-4; P7 -1.6,-4; P8 -0.8,-4; P9 0,-4; P10 0.8,-4; P11 1.6,-4; P12 2.4,-4; P13 3.2,-4; P14 4,-4; P15 4.8,-4; P16 5.6,-4; P17 6.4,-4; R1 -6.4,-4.8; R2 -5.6,-4.8; R3 -4.8,-4.8; R4 -4,-4.8; R5 -3.2,-4.8; R6 -2.4,-4.8; R7 -1.6,-4.8; R8 -0.8,-4.8; R9 0,-4.8; R10 0.8,-4.8; R11 1.6,-4.8; R12 2.4,-4.8; R13 3.2,-4.8; R14 4,-4.8; R15 4.8,-4.8; R16 5.6,-4.8; R17 6.4,-4.8; T1 -6.4,-5.6; T2 -5.6,-5.6; T3 -4.8,-5.6; T4 -4,-5.6; T5 -3.2,-5.6; T6 -2.4,-5.6; T7 -1.6,-5.6; T8 -0.8,-5.6; T9 0,-5.6; T10 0.8,-5.6; T11 1.6,-5.6; T12 2.4,-5.6; T13 3.2,-5.6; T14 4,-5.6; T15 4.8,-5.6; T16 5.6,-5.6; T17 6.4,-5.6; U1 -6.4,-6.4; U2 -5.6,-6.4; U3 -4.8,-6.4; U4 -4,-6.4; U5 -3.2,-6.4; U6 -2.4,-6.4; U7 -1.6,-6.4; U8 -0.8,-6.4; U9 0,-6.4; U10 0.8,-6.4; U11 1.6,-6.4; U12 2.4,-6.4; U13 3.2,-6.4; U14 4,-6.4; U15 4.8,-6.4; U16 5.6,-6.4; U17 6.4,-6.4
SOT95P280X100-5 = smd 1.116 x 0.589: 1 -1.242,0.95; 2 -1.242,0; 3 -1.242,-0.95; 4 1.242,-0.95; 5 1.242,0.95
TSSOP8 = smd 1.2 x 0.35: 1 -2.925,0.975; 2 -2.925,0.325; 3 -2.925,-0.325; 4 -2.925,-0.975; 5 2.925,-0.975; 6 2.925,-0.325; 7 2.925,0.325; 8 2.925,0.975
SOT95P280X110-6 = smd 1.259 x 0.609: 1 -1.228,0.95; 2 -1.228,0; 3 -1.228,-0.95; 4 1.228,-0.95; 5 1.228,0; 6 1.228,0.95
SO08-208 = smd 0.66 x 2.032: 1 -1.905,-3.498; 2 -0.635,-3.498; 3 0.635,-3.498; 4 1.905,-3.498; 5 1.905,3.498; 6 0.635,3.498; 7 -0.635,3.498; 8 -1.905,3.498
L3230M = smd 1.2 x 2.7: 1 -1.4,0; 2 1.4,0
L0402 = smd 0.5 x 0.6: 1 -0.5,0; 2 0.5,0
321015RGB = smd 0.5 x 0.8: 1 -0.415,0.4; 4 0.415,0.4 | smd 0.95 x 1.1: 2 -1.475,0; 3 1.475,0
3215 = smd 1.3 x 1.1: 1 -1.15,-0.9; 2 1.15,-0.9; 3 1.15,0.9; 4 -1.15,0.9
3215' = smd 1 x 1.8: 1 -1.25,0; 2 1.25,0
R0402 = smd 0.6 x 0.7: 1 -0.5,0; 2 0.5,0
R0603 = smd 0.8 x 1: 1 -0.75,0; 2 0.75,0
R0603' = smd 1 x 1.1: 1 -0.85,0; 2 0.85,0
MA05-2 = drill 1.016 pad 1.5 octagon: 1 -5.08,-1.27; 2 -5.08,1.27; 3 -2.54,-1.27; 4 -2.54,1.27; 5 0,-1.27; 6 0,1.27; 7 2.54,-1.27; 8 2.54,1.27; 9 5.08,-1.27; 10 5.08,1.27
4D02 = smd 0.3 x 0.6: 1 -0.75,-0.65; 2 -0.25,-0.65; 3 0.25,-0.65; 4 0.75,-0.65; 5 0.75,0.55; 6 0.25,0.55; 7 -0.25,0.55; 8 -0.75,0.55
MA18-2 = drill 1.016 pad 1.5 octagon: 1 -21.59,-1.27; 2 -21.59,1.27; 3 -19.05,-1.27; 4 -19.05,1.27; 5 -16.51,-1.27; 6 -16.51,1.27; 7 -13.97,-1.27; 8 -13.97,1.27; 9 -11.43,-1.27; 10 -11.43,1.27; 11 -8.89,-1.27; 12 -8.89,1.27; 13 -6.35,-1.27; 14 -6.35,1.27; 17 -1.27,-1.27; 18 -1.27,1.27; 19 1.27,-1.27; 20 1.27,1.27; 21 3.81,-1.27; 22 3.81,1.27; 23 6.35,-1.27; 24 6.35,1.27; 25 8.89,-1.27; 26 8.89,1.27; 27 11.43,-1.27; 28 11.43,1.27; 29 13.97,-1.27; 30 13.97,1.27; 31 16.51,-1.27; 32 16.51,1.27; 33 19.05,-1.27; 34 19.05,1.27; 35 21.59,-1.27; 36 21.59,1.27 | drill 1.016 octagon: 15 -3.81,-1.27; 16 -3.81,1.27
SOT23-BEC = smd 1 x 1.4: B -0.95,-1.1; C 0,1.1; E 0.95,-1.1
B1,27 = smd 1.27 x 1.27: TP 0,0
FBGA54 = smd 0.4 x 0.4: A1 -3.2,3.2; A2 -2.4,3.2; A3 -1.6,3.2; A7 1.6,3.2; A8 2.4,3.2; A9 3.2,3.2; B1 -3.2,2.4; B2 -2.4,2.4; B3 -1.6,2.4; B7 1.6,2.4; B8 2.4,2.4; B9 3.2,2.4; C1 -3.2,1.6; C2 -2.4,1.6; C3 -1.6,1.6; C7 1.6,1.6; C8 2.4,1.6; C9 3.2,1.6; D1 -3.2,0.8; D2 -2.4,0.8; D3 -1.6,0.8; D7 1.6,0.8; D8 2.4,0.8; D9 3.2,0.8; E1 -3.2,0; E2 -2.4,0; E3 -1.6,0; E7 1.6,0; E8 2.4,0; E9 3.2,0; F1 -3.2,-0.8; F2 -2.4,-0.8; F3 -1.6,-0.8; F7 1.6,-0.8; F8 2.4,-0.8; F9 3.2,-0.8; G1 -3.2,-1.6; G2 -2.4,-1.6; G3 -1.6,-1.6; G7 1.6,-1.6; G8 2.4,-1.6; G9 3.2,-1.6; H1 -3.2,-2.4; H2 -2.4,-2.4; H3 -1.6,-2.4; H7 1.6,-2.4; H8 2.4,-2.4; H9 3.2,-2.4; J1 -3.2,-3.2; J2 -2.4,-3.2; J3 -1.6,-3.2; J7 1.6,-3.2; J8 2.4,-3.2; J9 3.2,-3.2
FIDUCIAL_1MM = smd 1 x 1: 1 0,0
MA05-1 = drill 1.016 pad 1.5 octagon: 1 -5.08,0; 2 -2.54,0; 3 0,0; 4 2.54,0; 5 5.08,0

### Placement (x,y rotation side)
C1  43.5,33.9 180 top
C2  34.4,33.9 180 top
C3  28.8,33.9 180 top
C4  19.9,27.8 270 top
C5  19.9,24 270 top
C6  19.9,18.1 270 top
C7  27.5,23.1 180 top
C8  28.9,12.4 270 bottom
C9  35.05,15.55 0 bottom
C10  39.7,15.6 270 bottom
C11  65.7,14.1 180 top
C12  53.5,27.7 0 top
C13  34.8,17.5 270 bottom
C14  37.7,15.3 0 bottom
C15  45.3,23 90 top
C16  26.4,33.9 180 top
C17  45.3,20.1 270 top
C18  52.7,32.7 90 top
C20  29.1,14.6 90 bottom
C21  38.2,28.3 90 top
C22  40,28.3 90 top
C25  42.4,30 90 top
C26  41.8,32 270 top
C27  27,14 270 top
C28  27,16.8 90 top
C29  65.4,13 180 top
C30  61.4,6 0 top
C31  66,6 0 top
C32  23.4,8.2 180 top
C33  65.4,11.7 180 top
C34  71.8,23.2 90 top
C35  54.3,24.6 0 bottom
C36  61,26 270 top
C37  56.05,24.6 0 bottom
C38  51.6,25 90 top
C39  74.4,22.8 270 top
C40  77.8,27.6 270 top
C41  67.8,33.8 0 top
C42  62.8,33.8 0 top
C43  69.4,38.35 90 top
C44  17.6,8.2 180 top
C45  7.4,33 90 top
C46  10.4,33 90 top
C47  12,33 90 top
C48  -5.4,28.6 0 top  (outside the outline)
C49  -7.4,28.6 180 top  (outside the outline)
C50  -6.4,30 270 top  (outside the outline)
C51  63,4.2 90 top
C52  65.2,4.2 90 top
C53  69.4,34.8 270 top
C54  54.6,36.4 180 top
C55  54.6,38.6 180 top
C56  72.6,34.6 270 top
C57  58.9,34.9 0 top
C58  78.2,35.8 0 top
C59  78.2,34.4 0 top
C60  64.4,34.8 270 top
C61  64.4,38.35 90 top
C62  5.4,24 270 top
C63  -7.8,22.6 270 top  (outside the outline)
CON1  1.5,30 270 top
CON2  14.6,14 270 top
IC1  37.2,18.2 180 top
IC3  20.2,10.4 180 top
IC4  9.4,30.2 180 top
IC5  71.6,37.6 270 top
IC6  10.8,25 90 top
IC7  58,37.6 270 top
L1  75.2,36.4 270 top
L2  62,37.6 270 top
L3  51.5,32.7 270 top
LED1  1,23.6 270 top
Q1  44.6,30.2 180 top
Q2  32.768kHz  [3215']  24.4,16.6 90 top
R1  38.8,26.9 0 top
R2  65.6,15.6 0 top
R3  20.2,8.2 180 top
R4  24.5,21.4 0 top
R5  -5.2,30 270 top  (outside the outline)
R6  -7.6,30 270 top  (outside the outline)
R7  -7.2,27.2 90 top  (outside the outline)
R8  -5.6,27.2 90 top  (outside the outline)
R9  61.4,4.8 0 top
R10  61.4,3.6 0 top
R11  64,4.2 270 top
R12  66.2,4.2 270 top
R13  70.8,34.8 270 top
R14  5.8,33 90 top
R15  56.35,34.9 180 top
R16  78.2,37 180 top
R17  78.2,38.2 0 top
R18  60.8,34.9 0 top
R19  62.8,34.9 0 top
R20  3,25.2 180 top
R21  3,24 180 top
R22  3,22.8 180 top
R23  -1.4,22.2 90 top
R24  -3.6,23.6 270 top  (outside the outline)
R25  0/dnp  [R0603']  66.8,38.2 0 top
R26  0/dnp  [R0603']  66.8,35.4 180 top
R27  24.5,19.7 180 top
R28  21.8,33.4 180 top
R29  21.8,32.2 180 top
R30  5.6,26.4 270 top
R35  17,14 0 top
R36  14.4,30.2 90 top
R37  18.8,32.6 90 top
R38  18.6,30.2 90 top
RMII  13.49,3 0 top
RN1  43.6,5 315 top
RN2  47.4,4.4 135 top
RN3  39,4.2 135 top
RN4  41,4.2 135 top
RN5  46,2.6 135 top
RN6  43.4,2.2 135 top
SV1  30,37 180 bottom
T1  -6.4,24.2 180 top  (outside the outline)
TP1  51.4,1 0 top
TP2  53.45,1 0 top
TP3  52.4,2.4 0 top
U1  55.6,14.8 90 top
U2  56.4,23 90 top
U$1  22.6,1.4 0 top
U$2  14.2,32.6 0 top
U$3  54.2,34.8 0 top
USB  65.97,1.73 0 top

### Tracks (layer width: path | path; a pad name or v marks a point on that pad's centre or on a via)
!MRST  (2 unrouted)
!RST  (2 unrouted)
!WKUP  (1 unrouted)
+1V8  (via drill 0.2, 0.3, 0.4, 0.6)  (12 unrouted)
  Top 0.152: C17.1 45.4,20.6 45.6,20.4 45.9,20.4 v46,20.3 | 43,21.6 44,21.6 44.8,22.4 45.2,22.4 C15.1 45.3,22.1 v45.1,21.9
  Top 0.2: L2.2 61.3,35.5 R18.2 | C16.1 v27.5,33.9
  Top 0.6: C61.1 v64.4,36.6 | C60.1 v64.4,36.6 | L2.2 64,36.2 v64.4,36.6
  Route15 0.8: 66.4,37.28 65.04,37.28
  Route15 1: 65.04,37.28 64.4,36.64 v64.4,36.6 62.8,35
  other vias: 66.4,39.2 65.6,39.2 65.6,37.2 66.4,37.2
  pour Top (isolate 0.2, no thermals): 65.2,39.6 65.2,37 66.8,37 66.8,39.6
+3V3  (via drill 0.3, 0.4)  (36 unrouted)
  Top 0.2: 29.3,33.85 C3.1 v29.9,33.9 | C2.1 v35.6,33.9 | C1.1 44.7,33.9 v44.8,34
  Route15 0.4: v29.9,33.9 30,34
  Route15 1: v76.4,34 v75.2,34 v74.2,34 | 66.4,36.18 v66.4,34.4 66.4,33.8
  other vias: 66.4,36.4 65.6,36.4 65.6,34.4 51,34
  pour Top (isolate 0.2, no thermals): 73.8,35.8 76.6,35.8 77.2,36.4 77.2,37.4 78,37.4 78,33.8 73.8,33.8
  pour Top (isolate 0.2, no thermals): 65.2,36.6 66.8,36.6 66.8,34 65.2,34
+5V  (via drill 0.6)  (3 unrouted)
  Top 0.6: C53.1 v69.4,36.6 69.4,37.6 69.3,37.5 C43.1 70.3,37.5 70.65,37.85 IC5.3 | IC7.3 57.05,38.25 v56.4,37.6 | C55.1 56.4,37.65 v56.4,37.6 | C54.1 55.45,36.65 v56.4,37.6
  Bottom 1: v56.4,37.6 56.4,34 | 69.4,33.8 v69.4,36.6
ADDR0  (1 unrouted)
ADDR1  (via drill 0.2)  (1 unrouted)
  Top 0.152: U2.E8 56,25 56,23.6 v56.4,23.2
ADDR2  (2 unrouted)
ADDR3  (2 unrouted)
ADDR4  (2 unrouted)
ADDR5  (2 unrouted)
ADDR6  (2 unrouted)
ADDR7  (2 unrouted)
ADDR8  (2 unrouted)
ADDR9  (2 unrouted)
ADDR10  (2 unrouted)
ADDR11  (2 unrouted)
ADDR13  (2 unrouted)
ADDR14  (2 unrouted)
ADDR16  (2 unrouted)
ADDR17  (2 unrouted)
CAS  (via drill 0.2)  (3 unrouted)
  other vias: 56.8,15.8
CFIOR_NBS1_NWR1  (1 unrouted)
CFIOW_NBS3_NWR3  (1 unrouted)
DATA0  (1 unrouted)
DATA1  (2 unrouted)
DATA2  (2 unrouted)
DATA3  (1 unrouted)
DATA4  (1 unrouted)
DATA5  (1 unrouted)
DATA6  (1 unrouted)
DATA7  (1 unrouted)
DATA8  (2 unrouted)
DATA9  (2 unrouted)
DATA10  (1 unrouted)
DATA11  (1 unrouted)
DATA12  (1 unrouted)
DATA13  (1 unrouted)
DATA14  (1 unrouted)
DATA15  (1 unrouted)
DATA16  (via drill 0.2)  (1 unrouted)
  Top 0.154: U2.A8 v52.8,25.8
  Bottom 0.154: v52.8,25.8 52.4,25.4 52.4,24.2 51.8,23.6
DATA17  (via drill 0.2)  (1 unrouted)
  Top 0.154: U2.B9 v53.6,25.8
  Bottom 0.154: v53.6,25.8 52.8,25 52.8,24 52.2,23.4
DATA18  (1 unrouted)
  Top 0.154: U2.B8 53.6,25 53.6,23.4 53.2,23
DATA19  (via drill 0.2)  (1 unrouted)
  Top 0.154: U2.C9 v54.4,25.8
  Bottom 0.154: v54.4,25.8 54,25.4 53.8,25.4 53.2,24.8 53.2,23.8 52.6,23.2
DATA20  (1 unrouted)
  Top 0.154: U2.C8 54.4,25 54.4,23.4 54,23
DATA21  (via drill 0.2)  (1 unrouted)
  Top 0.154: U2.D9 v55.2,25.8
  Bottom 0.154: v55.2,25.8 54.48,25.08 54.27,24.87 54.27,24.33 54.4,24.2 54.4,23.2 54,22.8
DATA22  (1 unrouted)
  Top 0.154: U2.D8 55.2,25 55.2,23.6 54.4,22.8
DATA23  (via drill 0.2)  (1 unrouted)
  Top 0.154: U2.E9 v56,25.8
  Bottom 0.154: v56,25.8 56,23.8 54.8,22.6
DATA24  (1 unrouted)
DATA25  (1 unrouted)
DATA26  (1 unrouted)
DATA27  (1 unrouted)
DATA28  (1 unrouted)
DATA29  (1 unrouted)
DATA30  (1 unrouted)
DATA31  (1 unrouted)
FIQ  (1 unrouted)
GND  (via drill 0.2, 0.3, 0.4, 0.6)  (92 unrouted)
  Top 0.152: C17.2 45.4,19.6 45.5,19.5 v46,19.5 | v45.2,24.4 45.3,24.3 C15.2 44.7,23.5 44.4,23.2 43,23.2 | U2.D7 v55.6,24 | U2.B7 v54,24
  Top 0.154: U2.E3 v56.4,22 | U2.C3 v54.8,22 | U2.A3 v53.2,22
  Top 0.2: 28.25,33.85 C3.2 28.3,34.5 v28.4,34.6 | C2.2 33.9,34.5 v34,34.6 | R17.2 78.7,38.5 78,39.2 v76.4,39.2 | C1.2 v42.3,33.9 | C16.2 v25.3,33.9
  Top 0.4: 79,34.35 C59.2 79.05,34.45 | C58.2 78.4,35.15 v78.4,35.1 79.05,34.45 | 79.2,34.3 79.05,34.45 | C53.2 68.45,33.95 C41.2 | R19.2 C42.2 63.45,33.95 C60.2 v64.4,34.7 | C61.2 v64.4,38.4
  Top 0.6: C43.2 v69.4,38.4 | IC7.1 59.77,38.83 v59.8,38.8 | C54.2 53.75,37.35 | 53.75,37.35 v53.8,37.4 | C55.2 53.75,37.35
  Bottom 0.4: C35.2 53.8,24.2 v54,24 | C37.2 55.55,24.05 v55.6,24
  other vias: 74,39.2 75.2,39.2
  pour Route2 (isolate 0.6, no thermals): -1,-1 -1,41 81,41 81,-1
  pour Top (isolate 0.2, no thermals): 72.4,39.6 72.4,38.4 73.4,38.4 73.8,38.8 77,38.8 77,39.6
GPIO31  (1 unrouted)
  Top 0.2: 46.25,33.95 45.4,34.8 45.4,37.16 SV1.31
GPIO32  (1 unrouted)
  Top 0.2: 46.75,35.49 SV1.32
GPIO33  (1 unrouted)
  Top 0.2: 47.25,34.65 47.8,35.2 47.8,37.02 SV1.33
GPIO34  (1 unrouted)
  Top 0.2: 47.75,34.43 SV1.34
GPIO35  (1 unrouted)
  Top 0.2: 50.3,35.1 50.3,36.6 51.59,37.89 SV1.35
GPIO36  (1 unrouted)
  Top 0.2: 50.4,34.6 50.8,34.6 51.59,35.39 SV1.36
HDMA  (1 unrouted)
HDPA  (1 unrouted)
HSE_IN  (2 unrouted)
HSE_OUT  (2 unrouted)
I2C_SCL  (2 unrouted)
I2C_SDA  (2 unrouted)
IRQ1  (1 unrouted)
IRQ2  (1 unrouted)
LED_BLUE  (1 unrouted)
LED_GREEN  (1 unrouted)
LED_RED  (1 unrouted)
LSE_IN  (2 unrouted)
LSE_OUT  (2 unrouted)
MCCDA  (2 unrouted)
MCCDT  (1 unrouted)
MCCK  (1 unrouted)
MCDA0  (1 unrouted)
MCDA1  (1 unrouted)
MCDA2  (1 unrouted)
MCDA3  (1 unrouted)
MII_EMDC  (1 unrouted)
MII_EMDIO  (1 unrouted)
MII_ERX0  (1 unrouted)
MII_ERX1  (1 unrouted)
MII_ERXER  (1 unrouted)
MII_ETX0  (1 unrouted)
MII_ETX1  (1 unrouted)
MII_ETXCK  (1 unrouted)
MII_ETXEN  (1 unrouted)
N$1  (1 unrouted)
N$2  (1 unrouted)
N$3
  Top 0.2: 73.6,37.6 73.6,37 73.3,36.7 73.3,34.8 C56.2
  Top 0.6: IC5.2 71.6,38 72,37.6 73.6,37.6 75,37.6 L1.1
N$4  (1 unrouted)
N$6  (1 unrouted)
N$8
  Top 0.2: 59.8,37.6 59.8,35.8 59.4,35.4 C57.2
  Top 0.6: IC7.2 58,38 58.4,37.6 59.8,37.6 60.4,37.6 61.8,39 L2.1
N$9  (1 unrouted)
N$10
  Top 0.2: C56.1 72.6,36.32 IC5.6
N$11
  Top 0.154: C57.1 58.95,35.45 IC7.6
N$14  (1 unrouted)
N$15
  Top 0.2: IC7.4 56.85,36.17 R15.1
N$17  (1 unrouted)
N$18  (1 unrouted)
N$20  (1 unrouted)
N$21
  Top 0.154: R19.1 61.65,34.25 60.95,34.25 R18.1 59.7,34.3 56.45,34.3 R15.2
N$22  (via drill 0.3)
  Top 0.2: R16.1 78.7,37.15 77.72,38.12 | 77.72,38.12 77.7,38.15 R17.1 | R13.2 71.7,34.3 v71.8,34.4 | v77,38.4 77.45,38.4 77.72,38.12
  Bottom 0.2: v71.8,34.4 75.8,38.4 v77,38.4
N$23  (1 unrouted)
NRST  (1 unrouted)
PLLRCA  (2 unrouted)
RAS  (via drill 0.2)  (4 unrouted)
  Top 0.152: 56.8,25 56.8,23.8
  other vias: 56.8,16.6
REG_EN  (via drill 0.3)
  Top 0.2: IC5.5 71.6,35.4 v71.8,35.2 | IC7.5 58,35.53 57.6,35.13 v57.6,34.9
  Bottom 0.2: v71.8,35.2 71.8,36.4 70.4,37.8 60.5,37.8 v57.6,34.9
SDA10  (2 unrouted)
SDCK  (2 unrouted)
SDCKE  (2 unrouted)
SDCS  (3 unrouted)
SDWE  (2 unrouted)
SPI_CLK  (2 unrouted)
  Top 0.2: 37.85,37.23 SV1.25
SPI_CSB  (1 unrouted)
SPI_MISO  (2 unrouted)
  Top 0.2: 40.93,35.73 SV1.28
SPI_MOSI  (via drill 0.3)  (3 unrouted)
  Top 0.2: 38.25,34.05 v38.4,34.2
  Bottom 0.2: v38.4,34.2 39.45,34.2 | 40.1,34.85 40.1,36.94 SV1.27
SPI_NSS  (1 unrouted)
  Top 0.2: SV1.26 38.89,36.49 40,37.6 40,39 39.53,39.47 38.27,39.47 37.6,38.8 37.6,37.8 37.45,37.65 37.45,34.25
UART_RXD0  (1 unrouted)
UART_RXD1  (1 unrouted)
  Bottom 0.2: SV1.16 26.59,35.33
UART_RXD2  (1 unrouted)
  Bottom 0.2: SV1.24 37.2,34.88
UART_TXD0  (1 unrouted)
  Bottom 0.2: SV1.11 22.4,36.98
UART_TXD1  (1 unrouted)
  Bottom 0.2: SV1.15 25,37.08 25,35 26,34
UART_TXD2  (1 unrouted)
  Bottom 0.2: SV1.23 37.7,36.92
USB_C_DM  (2 unrouted)
USB_C_DP  (2 unrouted)
USB_H1_DM  (3 unrouted)
USB_H1_DP  (3 unrouted)
USB_VCC  (3 unrouted)
USBC_DM  (2 unrouted)
USBC_DP  (3 unrouted)
USBC_ID  (2 unrouted)
USBC_PUPD  (2 unrouted)
USBC_VDET  (2 unrouted)
VDDBU  (1 unrouted)
VDDRAM  (via drill 0.2, 0.4)  (38 unrouted)
  Top 0.152: U2.E7 v56.4,24 | U2.C7 v54.8,24
  Top 0.154: U2.B3 v54,22 | U2.D3 v55.6,22
  Bottom 0.4: U2.C7 v54.8,24 | C37.1 56.55,24.15 v56.4,24
  other vias: 68.2,36.8 67.4,36.8 67.4,39.2 68.2,39.2
  pour Top (isolate 0.2, no thermals): 67.2,39.6 67.2,34.6 68.4,34.6 68.4,39.6
VEXT  (2 unrouted)

### Text on the board
tPlace: VDRD 2019